# EasyEDA Pro project GController.eprj, board GController
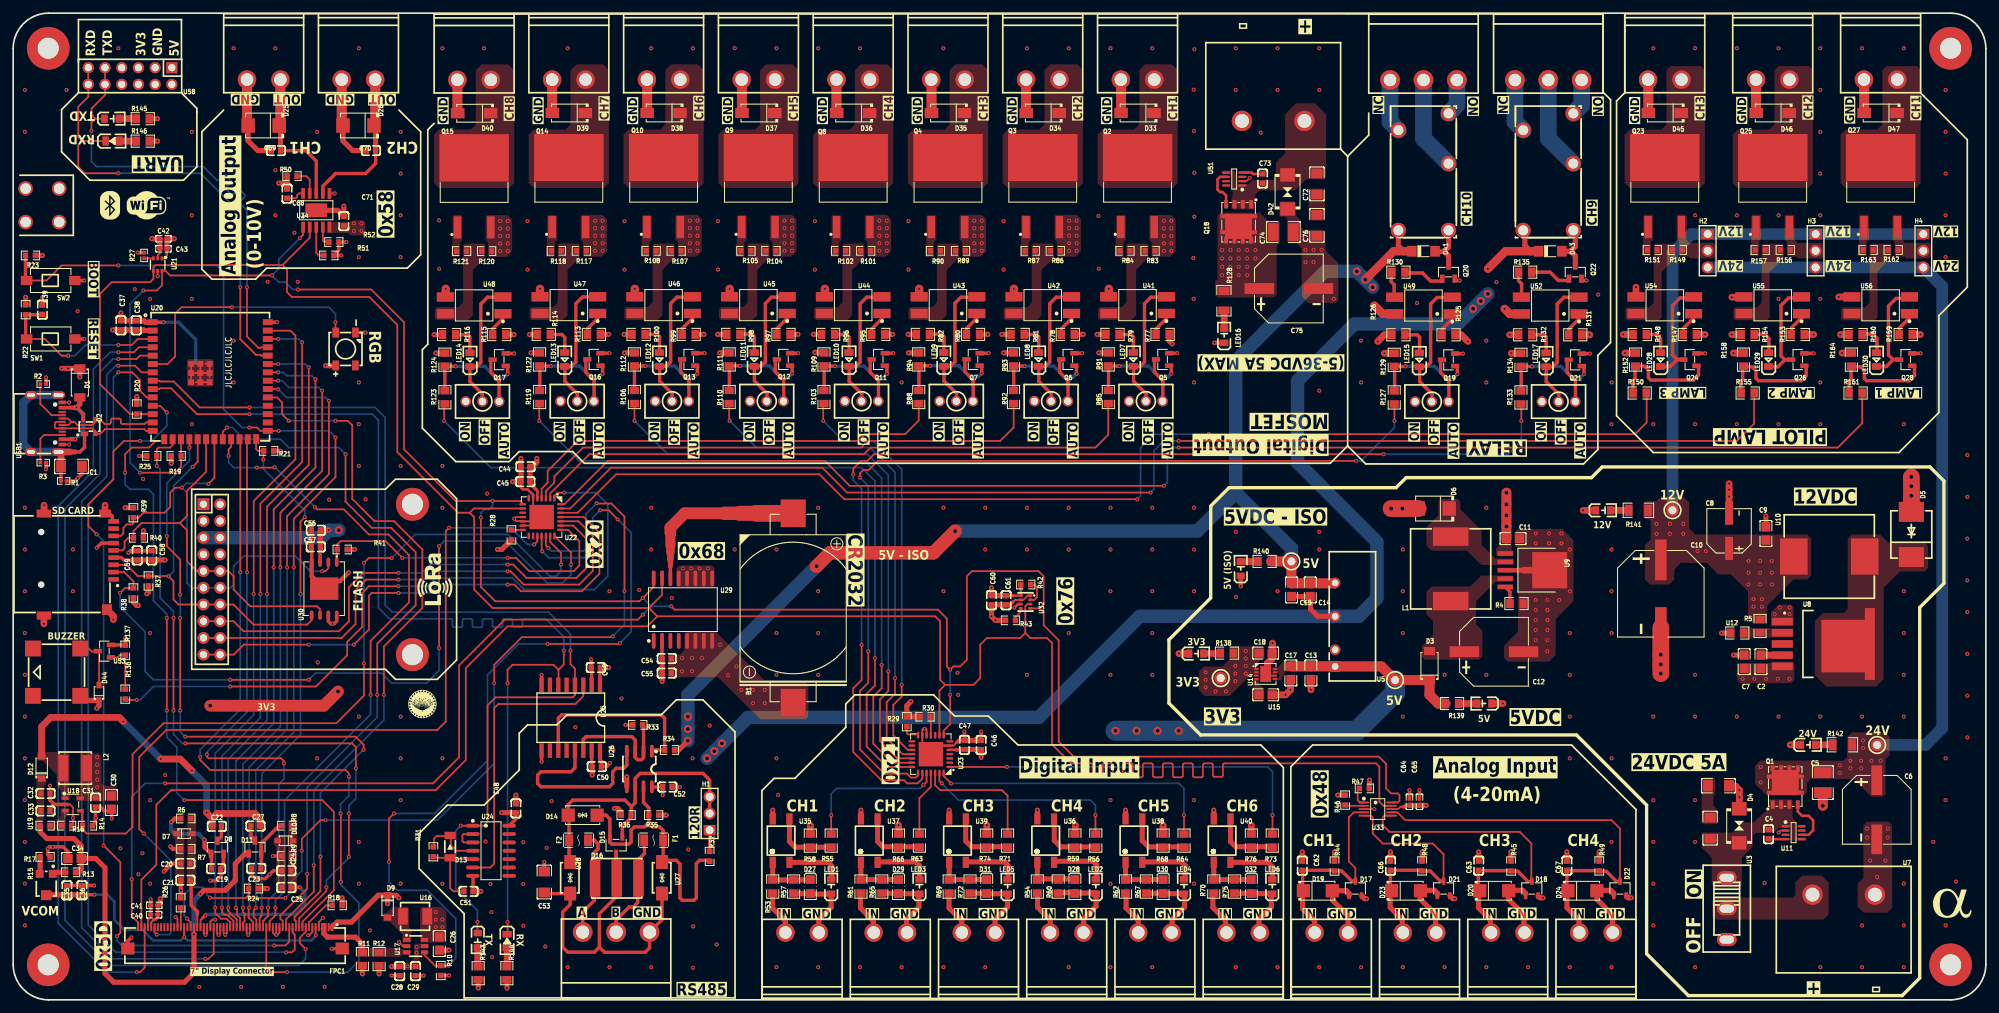
[diagram p17: board, top side]
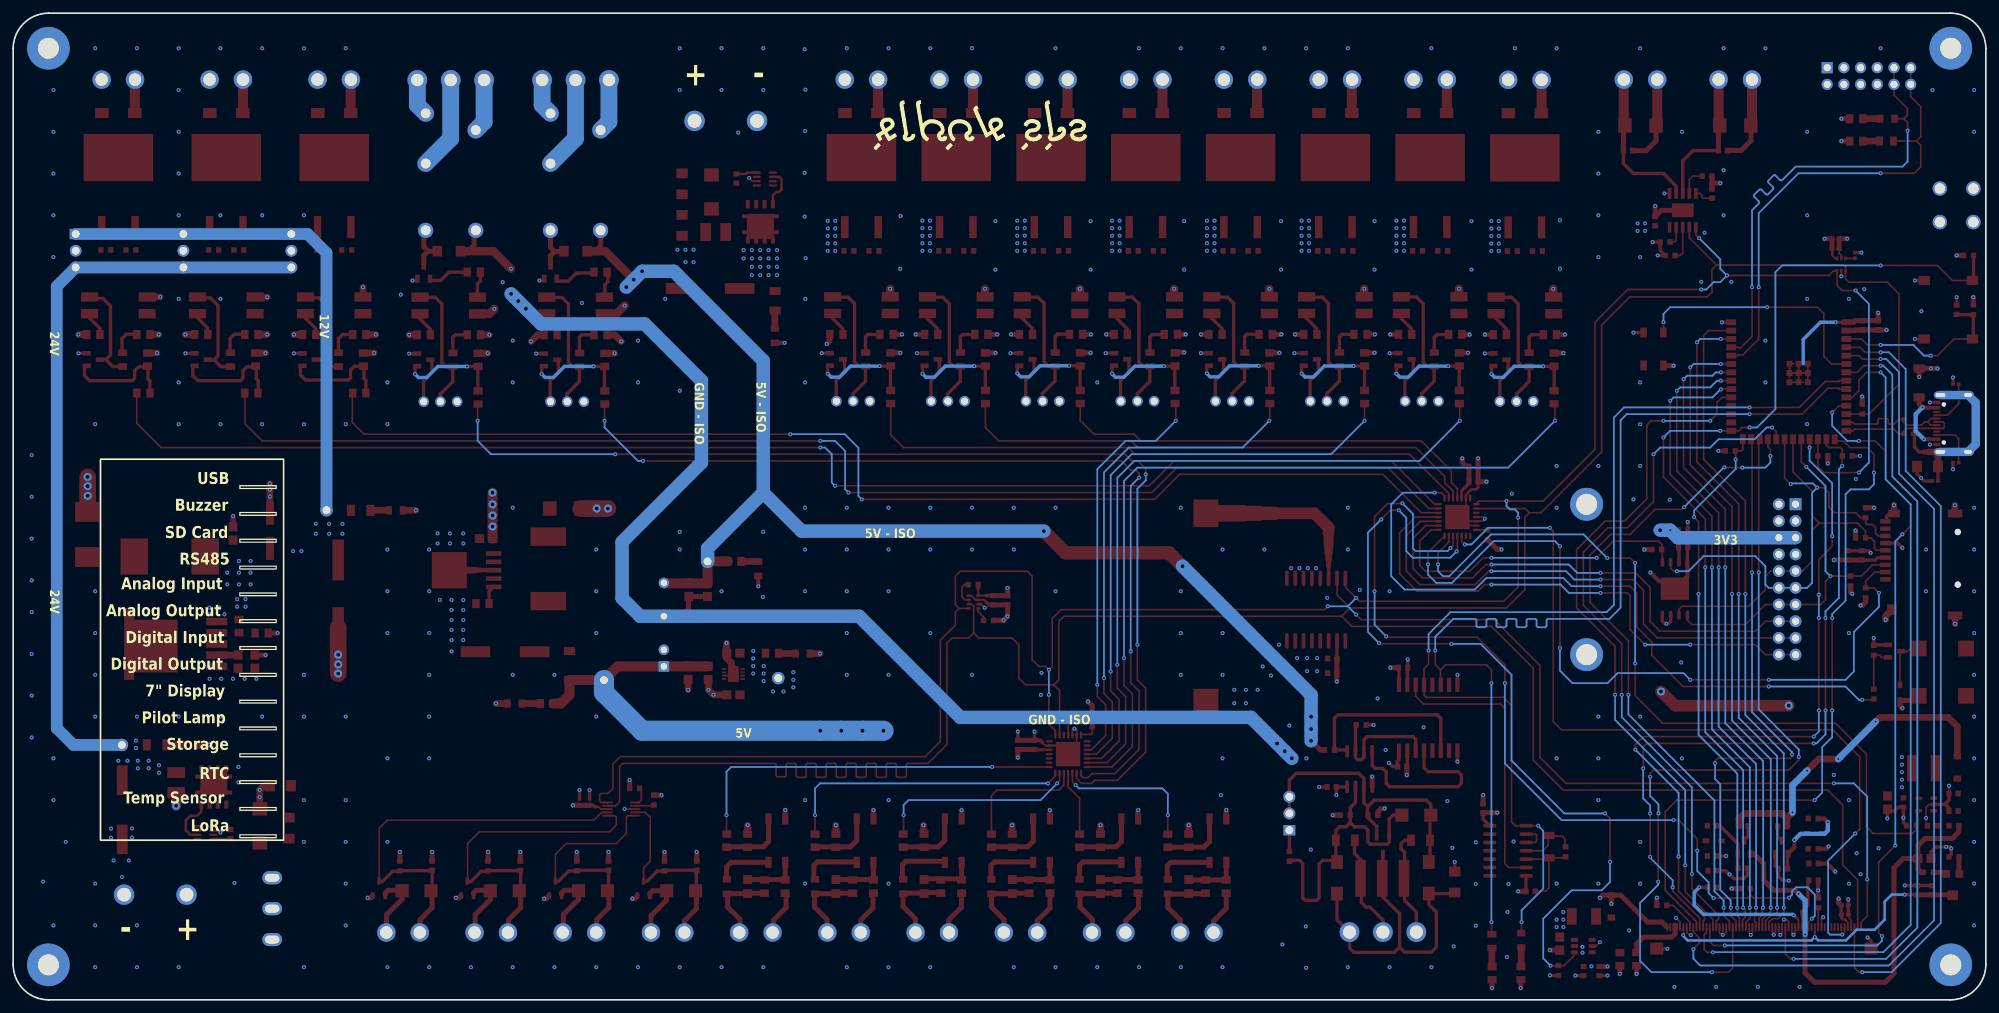
[diagram p18: board, bottom side, seen from below]

Outline 300 x 150 mm; copper layers: Top Layer, Ground, Power, Bottom Layer. Coordinates in mm from the lower left corner of the outline.
Outline path: 0,144.6 0,5.4 arc(1.58,1.58) 5.4,0 294.6,0 arc(298.42,1.58) 300,5.4 300,144.6 arc(298.42,148.42) 294.6,150 5.4,150 arc(1.58,148.42) 0,144.6
Stack: Top Layer 0.035mm Outer layer copper thickness 1oz / Dielectric1 0.2104mm 7628 RC49% 8.6mil / Ground 0.0152mm Inner layer copper thickness / Dielectric2 1.065mm 1.1mm H/HOZ Copper / Power 0.0152mm Inner layer copper thickness / Dielectric3 0.2104mm 7628 RC49% 8.6mil / Bottom Layer 0.035mm Outer layer copper thickness 1oz

## Design rules (mm)
net RS485A: RS4851
net RS485B: RS4851
net ESP_USB_P: USB
net ESP_USB_N: USB
net RS485A': RS4852
net RS485B': RS4852
net AI_SDA: I2C
net AI_SCL: I2C
net IO15: UART
net IO16: UART
net TXD0: UART1
net RXD0: UART1
net CC1: CC
net CC2: CC
net RS485_RXD': RS4853
net RS485_TXD': RS4853
template: Custom Config
spacing copperThickness1oz (default): track to track 0.152, other pairs 0.152 to 0.3
spacing copperThickness2oz: track to track 0.203, other pairs 0.152 to 0.3
spacing copperThicknessInner0.5oz: track to track 0.089, other pairs 0.152 to 0.3
track width copperThickness1oz (default): min 0.102, default 0.254, max 3.048
track width copperThickness2oz: min 0.203, default 0.254, max 2.54
track width copperThickness0.5oz: min 0.089, default 0.254, max 2.54
differential pair differentialPair (default): width min 0.127, default 0.254, max 2.54; gap min 0.152, default 0.152
via viaSize (default): diameter min 0.3, default 0.61, max 10; hole min 0.201, default 0.305, max 6.299
pour e1480 uses copperRegion1

## Placement (name value [footprint] x y rotation side)
B1  CR2032-BS-6-1  [BAT-TH_CR2032-BS-6-1]  118.62 59.58 90 top
BUZZER1  2.7kHz  [BUZ-SMD_4P-L8.5-W8.5-P8.50-BR]  6.6 49.81 90 top
C1  4.7nF  [C1206]  8.87 81.09 180 top
C2  1uF  [C0805]  265.79 51.41 270 top
C3  330nF  [C1206]  258.06 26.1 90 top
C4  100nF  [C0603]  266.95 25.18 90 top
C5  2.2uF  [C1210]  275.21 33.03 90 top
C6  220uF  [CAP-SMD_BD10.0-L10.3-W10.3-LS11.3-FD]  283.41 28.89 270 top
C7  1uF  [C0805]  263.25 51.41 270 top
C8  330uF  [CAP-SMD_BD6.3-L6.6-W6.6-LS7.3-FD]  260.95 71.3 90 top
C9  1uF  [C0805]  266.55 70.9 270 top
C10  470uF  [CAP-SMD_BD12.5-L13.0-W13.0-FD]  250.57 61.73 270 top
C11  1uF  [C0805]  228.09 70.12 180 top
C12  330uF  [CAP-SMD_BD10.0-L10.3-W10.3-LS11.3-FD]  225.2 52.92 0 top
C13  10uF  [C0805]  197.36 49.7 90 top
C14  10uF  [C0805]  197.26 62.32 90 top
C15  100nF  [C0805]  194.41 62.32 90 top
C16  330nF  [C1206]  259.33 32.55 0 top
C17  4.7uF  [C0805]  194.31 49.7 90 top
C18  4.7uF  [C0805]  190.47 52.72 180 top
C19  1uF  [C0603]  30.86 19.95 180 top
C20  100nF  [C0603]  26.2 20.72 0 top
C21  1uF  [C0603]  26.2 18.18 0 top
C22  100nF  [C0603]  30.97 26.38 180 top
C23  1uF  [C0603]  36.97 19.99 0 top
C24  1uF  [C0603]  41.55 19.63 0 top
C25  100nF  [C0603]  41.55 17.09 0 top
C26  10uF  [C0805]  64.8 8.56 90 top
C27  100nF  [C0603]  36.86 26.43 0 top
C28  1uF  [C0603]  58.79 4.37 90 top
C29  100nF  [C0603]  61.19 4.37 90 top
C30  10uF  [C0805]  14.95 29.99 90 top
C31  1uF  [C0603]  12.53 29.99 90 top
C32  1uF  [C0603]  4.91 31.37 180 top
C33  100nF  [C0603]  4.91 28.72 180 top
C34  10uF  [C0805]  9.34 21.49 0 top
C35  100nF  [C0603]  8.18 16.65 90 top
C36  1uF  [C0603]  10.46 16.65 270 top
C37  1uF  [C0603]  16.38 102.54 270 top
C38  100nF  [C0603]  18.72 102.54 270 top
C39  1uF  [C0603]  4.45 104.92 270 top
C40  100nF  [C0402]  21.44 12.94 0 top
C41  10uF  [C0402]  21.46 14.36 0 top
C42  10uF  [C0402]  22.86 115.71 0 top
C43  100nF  [C0402]  22.86 114.19 0 top
C44  1uF  [C0603]  77.9 81.06 180 top
C45  100nF  [C0603]  77.9 78.77 0 top
C46  1uF  [C0603]  147.21 38.76 90 top
C47  100nF  [C0603]  144.67 38.76 270 top
C48  100nF  [C0603]  76.45 29.1 270 top
C49  100nF  [C0603]  88.61 50.51 0 top
C50  100nF  [C0603]  88.76 35.46 0 top
C51  1nF  [C0603]  69.24 16.5 180 top
C52  100nF  [C0603]  99.49 32.36 180 top
C53  1nF  [C1206]  80.77 17.91 270 top
C54  100nF  [C0603]  99.38 51.89 180 top
C55  1uF  [C0603]  99.4 49.67 0 top
C56  10uF  [C0603]  46.03 71.4 180 top
C57  100nF  [C0603]  46.03 68.86 0 top
C58  10uF  [C0603]  21.08 67.58 90 top
C59  100nF  [C0603]  18.86 67.56 270 top
C60  1uF  [C0603]  148.77 60.75 90 top
C61  100nF  [C0603]  151 60.75 90 top
C62  10pF  [C0603]  196.04 20.4 270 top
C63  10pF  [C0603]  222.87 20.4 270 top
C64  100nF  [C0402]  212.34 30.11 270 top
C65  1uF  [C0402]  213.87 30.11 270 top
C66  10pF  [C0603]  209.46 20.4 270 top
C67  10pF  [C0603]  236.29 20.4 270 top
C68  1uF  [C0603]  41.65 122.57 90 top
C69  100nF  [C0603]  39.97 129.11 0 top
C70  100nF  [C0603]  54.42 129.11 0 top
C71  100nF  [C0603]  50.29 118.38 270 top
C72  330nF  [C1206]  198.27 124.04 90 top
C73  100nF  [C0603]  190.01 124.85 270 top
C74  2.2uF  [C1210]  193.16 116.73 180 top
C75  220uF  [CAP-SMD_BD10.0-L10.3-W10.3-LS11.3-FD]  194 108.14 0 top
C76  330nF  [C1206]  198.27 117.74 90 top
CN1  DB2ERC-5.08-3P-OG  [CONN-TH_3P-P5.08_DB2ERC-5.08-3P-OG]  91.69 10.3 0 top
CN2  DB2ERC-5.08-2P-GN  [CONN-TH_2P-P5.08_DB2ERC-5.08-2P]  200.47 10.24 0 top
CN3  DB2ERC-5.08-2P-GN  [CONN-TH_2P-P5.08_DB2ERC-5.08-2P]  227.29 10.24 0 top
CN4  DB2ERC-5.08-2P-GN  [CONN-TH_2P-P5.08_DB2ERC-5.08-2P]  213.88 10.24 0 top
CN5  DB2ERC-5.08-2P-GN  [CONN-TH_2P-P5.08_DB2ERC-5.08-2P]  240.71 10.24 0 top
CN6  DB2ERC-5.08-2P-GN  [CONN-TH_2P-P5.08_DB2ERC-5.08-2P]  38.1 139.9 180 top
CN7  DB2ERC-5.08-2P-GN  [CONN-TH_2P-P5.08_DB2ERC-5.08-2P]  52.51 139.9 180 top
CN8  DB2ERC-5.08-2P-GN  [CONN-TH_2P-P5.08_DB2ERC-5.08-2P]  119.98 10.24 0 top
CN9  DB2ERC-5.08-2P-GN  [CONN-TH_2P-P5.08_DB2ERC-5.08-2P]  160.22 10.24 0 top
CN10  DB2ERC-5.08-2P-GN  [CONN-TH_2P-P5.08_DB2ERC-5.08-2P]  133.4 10.24 0 top
CN11  DB2ERC-5.08-2P-GN  [CONN-TH_2P-P5.08_DB2ERC-5.08-2P]  173.64 10.24 0 top
CN12  DB2ERC-5.08-2P-GN  [CONN-TH_2P-P5.08_DB2ERC-5.08-2P]  146.81 10.24 0 top
CN13  DB2ERC-5.08-2P-GN  [CONN-TH_2P-P5.08_DB2ERC-5.08-2P]  187.05 10.24 0 top
CN14  DB2ERC-5.08-2P-GN  [CONN-TH_2P-P5.08_DB2ERC-5.08-2P]  170.99 139.9 180 top
CN15  DB2ERC-5.08-2P-GN  [CONN-TH_2P-P5.08_DB2ERC-5.08-2P]  156.58 139.9 180 top
CN16  DB2ERC-5.08-2P-GN  [CONN-TH_2P-P5.08_DB2ERC-5.08-2P]  142.16 139.9 180 top
CN17  DB2ERC-5.08-2P-GN  [CONN-TH_2P-P5.08_DB2ERC-5.08-2P]  127.75 139.9 180 top
CN18  DB2ERC-5.08-2P-GN  [CONN-TH_2P-P5.08_DB2ERC-5.08-2P]  113.34 139.9 180 top
CN19  DB2ERC-5.08-2P-GN  [CONN-TH_2P-P5.08_DB2ERC-5.08-2P]  98.92 139.9 180 top
CN20  DB2ERC-5.08-2P-GN  [CONN-TH_2P-P5.08_DB2ERC-5.08-2P]  84.51 139.9 180 top
CN21  DB2ERC-5.08-2P-GN  [CONN-TH_2P-P5.08_DB2ERC-5.08-2P]  70.1 139.87 180 top
CN22  DB2ERC-5.08-3P-BK  [CONN-TH_3P-P5.08_DB2ERC-5.08-3P-BK]  214.47 139.84 180 top
CN23  DB2ERC-5.08-3P-BK  [CONN-TH_3P-P5.08_DB2ERC-5.08-3P-BK]  233.46 139.84 180 top
CN24  DB2ERC-5.08-2P-GN  [CONN-TH_2P-P5.08_DB2ERC-5.08-2P]  251.17 139.9 180 top
CN25  DB2ERC-5.08-2P-GN  [CONN-TH_2P-P5.08_DB2ERC-5.08-2P]  267.59 139.9 180 top
CN26  DB2ERC-5.08-2P-GN  [CONN-TH_2P-P5.08_DB2ERC-5.08-2P]  284 139.9 180 top
D1  PMEG6030ETPX  [SOD-128_L3.7-W2.5-LS4.7-RD]  10.14 93.79 270 top
D2  PRTR5V0U2X,215  [SOT-143_L2.9-W1.3-P1.92-LS2.3-BR]  11.6 87.15 270 top
D3  PMEG6030ETPX  [SOD-128_L3.7-W2.5-LS4.7-RD]  215.39 50.82 90 top
D4  SMBJ33CA  [SMB_L4.3-W3.6-LS5.4-BI]  262.48 26.45 270 top
D5  B540C-13-F  [SMC_L7.1-W6.2-LS8.1-RD]  288.67 70.75 90 top
D6  B330B-13-F  [SMB_L4.6-W3.6-LS5.3-RD]  216.03 74.69 180 top
D7  BZT52C6V8S  [SOD-323_L1.8-W1.3-LS2.5-RD]  26.05 25.28 0 top
D8  BAT54S  [SOT-23-3_L2.9-W1.3-P1.90-LS2.4-BR]  31.06 23.19 270 top
D9  1N5819W  [SOD-123_L2.8-W1.8-LS3.7-RD]  56.95 14.21 270 top
D10  BZT52C18S  [SOD-323_L1.8-W1.3-LS2.5-RD]  41.4 24.18 180 top
D11  BAT54S  [SOT-23-3_L2.9-W1.3-P1.90-LS2.4-BR]  36.77 23.21 270 top
D12  1N5819W  [SOD-123_L2.8-W1.8-LS3.7-RD]  4.34 35.33 90 top
D13  LL4148  [LL-34_L3.5-W1.5-RD]  66.45 23.3 270 top
D14  SMAJ6.5CA  [SMA_L4.3-W2.6-LS5.1-BI]  86.61 28.08 0 top
D15  SM712  [SOT-23-3_L2.9-W1.6-P1.90-LS2.8-BR]  91.69 23.51 90 top
D16  3RL150M-5-S  [DIO-DT-SMD_3P-BD5.0-L7.2-P3.30]  91.8 18.48 0 top
D17  BAT54S,215  [SOT-23-3_L3.0-W1.7-P0.95-LS2.9-BR]  204.12 16.93 270 top
D18  BAT54S,215  [SOT-23-3_L3.0-W1.7-P0.95-LS2.9-BR]  230.95 16.93 270 top
D19  SMAJ33A  [SMA_L4.3-W2.6-LS5.2-RD]  198.41 16.59 0 top
D20  SMAJ33A  [SMA_L4.3-W2.6-LS5.2-RD]  225.24 16.59 0 top
D21  BAT54S,215  [SOT-23-3_L3.0-W1.7-P0.95-LS2.9-BR]  217.54 16.93 270 top
D22  BAT54S,215  [SOT-23-3_L3.0-W1.7-P0.95-LS2.9-BR]  244.36 16.93 270 top
D23  SMAJ33A  [SMA_L4.3-W2.6-LS5.2-RD]  211.82 16.59 0 top
D24  SMAJ33A  [SMA_L4.3-W2.6-LS5.2-RD]  238.65 16.59 0 top
D25  SMBJ12A  [SMB_L4.6-W3.6-LS5.3-RD]  38.1 132.92 180 top
D26  SMBJ12A  [SMB_L4.6-W3.6-LS5.3-RD]  52.51 132.92 180 top
D27  CD4148WSP  [D0805-RD]  121.23 17.22 270 top
D28  CD4148WSP  [D0805-RD]  161.47 17.22 270 top
D29  CD4148WSP  [D0805-RD]  134.64 17.22 270 top
D30  CD4148WSP  [D0805-RD]  174.88 17.22 270 top
D31  CD4148WSP  [D0805-RD]  148.06 17.22 270 top
D32  CD4148WSP  [D0805-RD]  188.3 17.22 270 top
D33  SS54  [SMA_L4.4-W2.8-LS5.4-R-RD]  170.99 134.82 180 top
D34  SS54  [SMA_L4.4-W2.8-LS5.4-R-RD]  156.58 134.82 180 top
D35  SS54  [SMA_L4.4-W2.8-LS5.4-R-RD]  142.16 134.82 180 top
D36  SS54  [SMA_L4.4-W2.8-LS5.4-R-RD]  127.75 134.82 180 top
D37  SS54  [SMA_L4.4-W2.8-LS5.4-R-RD]  113.34 134.82 180 top
D38  SS54  [SMA_L4.4-W2.8-LS5.4-R-RD]  98.92 134.82 180 top
D39  SS54  [SMA_L4.4-W2.8-LS5.4-R-RD]  84.51 134.82 180 top
D40  SS54  [SMA_L4.4-W2.8-LS5.4-R-RD]  70.1 134.79 180 top
D41  FDLL4148  [SOD-80_L3.5-W1.5-RD]  214.47 113.81 0 top
D42  SMBJ33CA  [SMB_L4.3-W3.6-LS5.4-BI]  193.8 122.82 90 top
D43  FDLL4148  [SOD-80_L3.5-W1.5-RD]  233.75 113.81 0 top
D44  1N4148WS  [SOD-323_L1.8-W1.3-LS2.5-RD]  13.05 46.69 90 top
D45  SS54  [SMA_L4.4-W2.8-LS5.4-R-RD]  251.17 134.82 180 top
D46  SS54  [SMA_L4.4-W2.8-LS5.4-R-RD]  267.59 134.82 180 top
D47  SS54  [SMA_L4.4-W2.8-LS5.4-R-RD]  284 134.82 180 top
F1  BSMD1206-020-30V  [F1206]  97.41 24.27 180 top
F2  BSMD1206-020-30V  [F1206]  85.98 24.27 0 top
FPC1  FPC-05FB-60PH20  [FPC-SMD_60P-P0.50_FPC-05FB-60PH20]  33.74 9.43 0 top
H1  2.54-1*3P针  [HDR-TH_3P-P2.54-V-M-1]  105.92 28.33 90 top
H2  2.54-1*3P针  [HDR-TH_3P-P2.54-V-M-1]  257.69 113.88 270 top
H3  2.54-1*3P针  [HDR-TH_3P-P2.54-V-M-1]  274.11 113.88 270 top
H4  2.54-1*3P针  [HDR-TH_3P-P2.54-V-M-1]  290.49 113.88 270 top
K1  ALQ105  [RELAY-TH_ALQ1XX]  214.47 125.87 90 top
K2  ALQ105  [RELAY-TH_ALQ1XX]  233.46 125.87 90 top
L1  33uH  [IND-SMD_L12.0-W12.0]  218.61 65.52 90 top
L2  22uH  [IND-SMD_L4.9-W4.9_NRS50XX]  9.44 35.22 180 top
LED1  LTST-C170TBKT  [LED0805-RD_BLUE]  124.4 17.22 90 top
LED2  LTST-C170TBKT  [LED0805-RD_BLUE]  164.65 17.22 90 top
LED3  LTST-C170TBKT  [LED0805-RD_BLUE]  137.82 17.22 90 top
LED4  LTST-C170TBKT  [LED0805-RD_BLUE]  178.06 17.22 90 top
LED5  LTST-C170TBKT  [LED0805-RD_BLUE]  151.23 17.22 90 top
LED6  LTST-C170TBKT  [LED0805-RD_BLUE]  191.47 17.22 90 top
LED7  NCD0805R1  [LED0805-R-RD]  170.36 97.36 90 top
LED8  NCD0805R1  [LED0805-R-RD]  155.94 97.36 90 top
LED9  NCD0805R1  [LED0805-R-RD]  141.53 97.36 90 top
LED10  NCD0805R1  [LED0805-R-RD]  127.11 97.36 90 top
LED11  NCD0805R1  [LED0805-R-RD]  112.7 97.36 90 top
LED12  NCD0805R1  [LED0805-R-RD]  98.29 97.36 90 top
LED13  NCD0805R1  [LED0805-R-RD]  83.87 97.36 90 top
LED14  NCD0805R1  [LED0805-R-RD]  69.47 97.32 90 top
LED15  NCD0805R1  [LED0805-R-RD]  213.84 97.3 90 top
LED16  17-215SURC/S530-A2/TR8  [LED0805-RD_RED]  184.17 100.98 90 top
LED17  NCD0805R1  [LED0805-R-RD]  233.11 97.3 90 top
LED18  17-215SURC/S530-A2/TR8  [LED0805-RD_RED]  179.92 52.64 0 top
LED19  17-215SURC/S530-A2/TR8  [LED0805-RD_RED]  223.73 45.05 180 top
LED20  17-215SURC/S530-A2/TR8  [LED0805-RD_RED]  186.69 65.55 90 top
LED21  17-215SURC/S530-A2/TR8  [LED0805-RD_RED]  241.8 74.42 0 top
LED22  17-215SURC/S530-A2/TR8  [LED0805-RD_RED]  272.96 38.77 0 top
LED23  17-215SURC/S530-A2/TR8  [LED0805-RD_RED]  70.66 9.05 270 top
LED24  SZYY0805YG  [LED0805-R-RD_GREEN]  75.12 8.93 270 top
LED25  17-215SURC/S530-A2/TR8  [LED0805-RD_RED]  14.99 133.96 0 top
LED26  SZYY0805YG  [LED0805-R-RD_GREEN]  15.11 130.56 0 top
LED27  XL-5050RGBC-WS2812B  [LED-SMD_4P-L5.0-W5.0-BL_XL-5050RGBC]  50.55 98.95 0 top
LED28  NCD0805R1  [LED0805-R-RD]  250.54 97.33 90 top
LED29  NCD0805R1  [LED0805-R-RD]  266.95 97.33 90 top
LED30  NCD0805R1  [LED0805-R-RD]  283.37 97.33 90 top
NOREF  -  [Pad_e1324]  60.72 52.48 0 top
NOREF#2  -  [Pad_e3840]  294.64 144.67 0 top
NOREF#3  -  [Pad_e1300]  60.72 75.34 0 top
NOREF#4  -  [Pad_e13738]  7 118.24 0 top
NOREF#5  -  [Pad_e13737]  7 123.34 0 top
NOREF#6  -  [Pad_e13739]  1.9 118.24 0 top
NOREF#7  -  [Pad_e3838]  294.64 5.32 0 top
NOREF#8  -  [Pad_e1349]  5.33 144.67 0 top
NOREF#9  -  [Pad_e3835]  5.33 5.32 0 top
NOREF#10  -  [Pad_e13735]  1.9 123.34 0 top
Q1  DMT6005LPS-13  [DFN-8_L6.0-W5.1-P1.27-LS6.2-BL]  269.49 32.42 0 top
Q2  IRF5305STRLPBF  [TO-263-2_L10.0-W9.1-P5.08-LS15.2-TL]  170.99 122.76 90 top
Q3  IRF5305STRLPBF  [TO-263-2_L10.0-W9.1-P5.08-LS15.2-TL]  156.58 122.76 90 top
Q4  IRF5305STRLPBF  [TO-263-2_L10.0-W9.1-P5.08-LS15.2-TL]  142.16 122.76 90 top
Q5  MMSS8050-L-TP  [SOT-23-3_L2.9-W1.3-P1.90-LS2.4-BR]  174.8 97.36 0 top
Q6  MMSS8050-L-TP  [SOT-23-3_L2.9-W1.3-P1.90-LS2.4-BR]  160.39 97.36 0 top
Q7  MMSS8050-L-TP  [SOT-23-3_L2.9-W1.3-P1.90-LS2.4-BR]  145.97 97.36 0 top
Q8  IRF5305STRLPBF  [TO-263-2_L10.0-W9.1-P5.08-LS15.2-TL]  127.75 122.76 90 top
Q9  IRF5305STRLPBF  [TO-263-2_L10.0-W9.1-P5.08-LS15.2-TL]  113.34 122.76 90 top
Q10  IRF5305STRLPBF  [TO-263-2_L10.0-W9.1-P5.08-LS15.2-TL]  98.92 122.76 90 top
Q11  MMSS8050-L-TP  [SOT-23-3_L2.9-W1.3-P1.90-LS2.4-BR]  131.56 97.36 0 top
Q12  MMSS8050-L-TP  [SOT-23-3_L2.9-W1.3-P1.90-LS2.4-BR]  117.15 97.36 0 top
Q13  MMSS8050-L-TP  [SOT-23-3_L2.9-W1.3-P1.90-LS2.4-BR]  102.73 97.36 0 top
Q14  IRF5305STRLPBF  [TO-263-2_L10.0-W9.1-P5.08-LS15.2-TL]  84.51 122.76 90 top
Q15  IRF5305STRLPBF  [TO-263-2_L10.0-W9.1-P5.08-LS15.2-TL]  70.1 122.72 90 top
Q16  MMSS8050-L-TP  [SOT-23-3_L2.9-W1.3-P1.90-LS2.4-BR]  88.32 97.36 0 top
Q17  MMSS8050-L-TP  [SOT-23-3_L2.9-W1.3-P1.90-LS2.4-BR]  73.91 97.32 0 top
Q18  DMT6005LPS-13  [DFN-8_L6.0-W5.1-P1.27-LS6.2-BL]  186.36 118.22 180 top
Q19  MMSS8050-L-TP  [SOT-23-3_L2.9-W1.3-P1.90-LS2.4-BR]  218.28 97.3 0 top
Q20  MMSS8050-L-TP  [SOT-23-3_L2.9-W1.3-P1.90-LS2.4-BR]  218.28 110.63 270 top
Q21  MMSS8050-L-TP  [SOT-23-3_L2.9-W1.3-P1.90-LS2.4-BR]  237.56 97.3 0 top
Q22  MMSS8050-L-TP  [SOT-23-3_L2.9-W1.3-P1.90-LS2.4-BR]  237.56 110.63 270 top
Q23  IRF5305STRLPBF  [TO-263-2_L10.0-W9.1-P5.08-LS15.2-TL]  251.17 122.76 90 top
Q24  MMSS8050-L-TP  [SOT-23-3_L2.9-W1.3-P1.90-LS2.4-BR]  254.98 97.33 0 top
Q25  IRF5305STRLPBF  [TO-263-2_L10.0-W9.1-P5.08-LS15.2-TL]  267.59 122.76 90 top
Q26  MMSS8050-L-TP  [SOT-23-3_L2.9-W1.3-P1.90-LS2.4-BR]  271.4 97.33 0 top
Q27  IRF5305STRLPBF  [TO-263-2_L10.0-W9.1-P5.08-LS15.2-TL]  284 122.76 90 top
Q28  MMSS8050-L-TP  [SOT-23-3_L2.9-W1.3-P1.90-LS2.4-BR]  287.81 97.33 0 top
R1  1MΩ  [R0402]  7.69 78.88 180 top
R2  5.1kΩ  [R0402]  4.57 93.61 180 top
R3  5.1kΩ  [R0402]  4.57 81.67 180 top
R4  47kΩ  [R0805]  228.63 60.24 0 top
R5  13kΩ  [R0805]  265.66 56.83 90 top
R6  1kΩ  [R0603]  26.26 27.57 0 top
R7  10kΩ  [R0603]  26.26 22.96 0 top
R8  1kΩ  [R0603]  41.61 26.48 0 top
R9  47kΩ  [R0603]  41.61 21.87 0 top
R10  4.7kΩ  [R0603]  65.02 4.46 270 top
R11  1.8Ω  [R0805]  53.11 6.19 90 top
R12  1.8Ω  [R0805]  55.65 6.19 90 top
R13  15kΩ  [R0603]  8.74 19.39 0 top
R14  10kΩ  [R0603]  11.3 26.48 180 top
R15  10kΩ  [RES-ADJ-SMD_3P-L3.0-W3.8-P1.75-BR]  5.03 17.54 90 top
R16  4.7kΩ  [R0603]  8.13 26.48 180 top
R17  6.8kΩ  [R0603]  4.86 21.74 180 top
R18  10kΩ  [R0603]  49.28 14.36 180 top
R19  4.7kΩ  [R0603]  24.79 82.69 180 top
R20  4.7kΩ  [R0603]  18.8 89.82 90 top
R21  10kΩ  [R0603]  38.86 83.45 180 top
R22  10kΩ  [R0603]  1.91 104.92 90 top
R23  10kΩ  [R0603]  2.63 113.17 0 top
R24  10kΩ  [R0603]  36.56 16.92 0 top
R25  10kΩ  [R0603]  21.08 82.69 0 top
R26  10kΩ  [R0603]  25.47 14.75 90 top
R27  10kΩ  [R0402]  19.91 113.17 90 top
R28  10kΩ  [R0603]  75.78 70.69 270 top
R29  10kΩ  [R0603]  135.9 42.29 90 top
R30  10kΩ  [R0603]  138.68 43.04 180 top
R31  56kΩ  [R0603]  63.91 22.51 90 top
R32  120Ω  [R0603]  105.92 21.81 90 top
R33  4.7kΩ  [R0603]  95 41.8 180 top
R34  10kΩ  [R0603]  99.82 37.99 0 top
R35  4.7kΩ  [R0603]  97.41 28.08 0 top
R36  4.7kΩ  [R0603]  93.22 28.08 0 top
R37  10kΩ  [R0603]  20.58 63.68 90 top
R38  10kΩ  [R0603]  18.29 61.86 90 top
R39  10kΩ  [R0603]  18.29 74.05 270 top
R40  10kΩ  [R0603]  19.05 70.24 180 top
R41  10kΩ  [R0603]  50.04 68.47 180 top
R42  10kΩ  [R0603]  154 63.13 180 top
R43  10kΩ  [R0603]  151.67 57.69 180 top
R44  150Ω  [R0603]  200.95 20.34 270 top
R45  150Ω  [R0603]  227.8 20.35 270 top
R46  10kΩ  [R0603]  202.56 30.37 270 top
R47  10kΩ  [R0603]  205.49 32.14 180 top
R48  150Ω  [R0603]  214.27 20.36 270 top
R49  150Ω  [R0603]  241.21 20.36 270 top
R50  4.7kΩ  [R0603]  42.41 125.23 180 top
R51  4.7kΩ  [R0603]  48.01 113.17 180 top
R52  4.7kΩ  [R0603]  48.77 115.2 180 top
R53  4.7kΩ  [R0805]  115.51 17.22 90 top
R54  4.7kΩ  [R0805]  155.76 17.22 90 top
R55  100Ω  [R0805]  124.4 24.21 270 top
R56  100Ω  [R0805]  164.65 24.21 270 top
R57  10kΩ  [R0805]  118.69 17.22 90 top
R58  10kΩ  [R0805]  121.23 24.21 270 top
R59  10kΩ  [R0805]  161.47 24.21 270 top
R60  10kΩ  [R0805]  158.93 17.22 90 top
R61  4.7kΩ  [R0805]  128.93 17.22 90 top
R62  4.7kΩ  [R0805]  169.17 17.22 90 top
R63  100Ω  [R0805]  137.82 24.21 270 top
R64  100Ω  [R0805]  178.06 24.21 270 top
R65  10kΩ  [R0805]  132.1 17.22 90 top
R66  10kΩ  [R0805]  134.64 24.21 270 top
R67  10kΩ  [R0805]  172.34 17.22 90 top
R68  10kΩ  [R0805]  174.88 24.21 270 top
R69  4.7kΩ  [R0805]  142.34 17.22 90 top
R70  4.7kΩ  [R0805]  182.58 17.22 90 top
R71  100Ω  [R0805]  151.23 24.21 270 top
R72  10kΩ  [R0805]  145.52 17.22 90 top
R73  100Ω  [R0805]  191.47 24.21 270 top
R74  10kΩ  [R0805]  148.06 24.21 270 top
R75  10kΩ  [R0805]  185.76 17.22 90 top
R76  10kΩ  [R0805]  188.3 24.21 270 top
R77  4.7kΩ  [R0805]  174.8 101.17 180 top
R78  4.7kΩ  [R0805]  160.39 101.17 180 top
R79  2kΩ  [R0805]  167.18 101.17 180 top
R80  4.7kΩ  [R0805]  145.97 101.17 180 top
R81  2kΩ  [R0805]  152.77 101.17 180 top
R82  2kΩ  [R0805]  138.35 101.17 180 top
R83  10kΩ  [R0603]  172.9 113.87 0 top
R84  1kΩ  [R0603]  169.09 113.87 180 top
R85  4.7kΩ  [R0805]  166.55 91.64 90 top
R86  10kΩ  [R0603]  158.48 113.87 0 top
R87  1kΩ  [R0603]  154.67 113.87 180 top
R88  4.7kΩ  [R0805]  137.72 91.64 90 top
R89  10kΩ  [R0603]  144.07 113.87 0 top
R90  1kΩ  [R0603]  140.26 113.87 180 top
R91  100kΩ  [R0805]  166.55 97.36 270 top
R92  4.7kΩ  [R0805]  152.13 91.64 90 top
R93  100kΩ  [R0805]  152.13 97.36 270 top
R94  100kΩ  [R0805]  137.72 97.36 270 top
R95  4.7kΩ  [R0805]  131.56 101.17 180 top
R96  2kΩ  [R0805]  123.94 101.17 180 top
R97  4.7kΩ  [R0805]  117.15 101.17 180 top
R98  2kΩ  [R0805]  109.53 101.17 180 top
R99  4.7kΩ  [R0805]  102.73 101.17 180 top
R100  2kΩ  [R0805]  95.11 101.17 180 top
R101  10kΩ  [R0603]  129.66 113.87 0 top
R102  1kΩ  [R0603]  125.84 113.87 180 top
R103  4.7kΩ  [R0805]  123.31 91.64 90 top
R104  10kΩ  [R0603]  115.24 113.87 0 top
R105  1kΩ  [R0603]  111.43 113.87 180 top
R106  4.7kΩ  [R0805]  94.48 91.64 90 top
R107  10kΩ  [R0603]  100.83 113.87 0 top
R108  1kΩ  [R0603]  97.02 113.87 180 top
R109  100kΩ  [R0805]  123.31 97.36 270 top
R110  4.7kΩ  [R0805]  108.89 91.64 90 top
R111  100kΩ  [R0805]  108.89 97.36 270 top
R112  100kΩ  [R0805]  94.48 97.36 270 top
R113  4.7kΩ  [R0805]  88.32 101.17 180 top
R114  2kΩ  [R0805]  80.7 101.17 180 top
R115  4.7kΩ  [R0805]  73.91 101.13 180 top
R116  2kΩ  [R0805]  66.29 101.13 180 top
R117  10kΩ  [R0603]  86.41 113.87 0 top
R118  1kΩ  [R0603]  82.6 113.87 180 top
R119  4.7kΩ  [R0805]  80.06 91.64 90 top
R120  10kΩ  [R0603]  72.01 113.83 0 top
R121  1kΩ  [R0603]  68.2 113.83 180 top
R122  100kΩ  [R0805]  80.06 97.36 270 top
R123  4.7kΩ  [R0805]  65.66 91.61 90 top
R124  100kΩ  [R0805]  65.66 97.32 270 top
R125  4.7kΩ  [R0805]  218.28 101.11 180 top
R126  2kΩ  [R0805]  210.66 101.11 180 top
R127  4.7kΩ  [R0805]  210.03 91.58 90 top
R128  4.7kΩ  [R1206]  184.13 106.27 90 top
R129  100kΩ  [R0805]  210.03 97.3 270 top
R130  4.7kΩ  [R0805]  210.66 110.63 0 top
R131  4.7kΩ  [R0805]  237.56 101.11 180 top
R132  2kΩ  [R0805]  229.94 101.11 180 top
R133  4.7kΩ  [R0805]  229.3 91.58 90 top
R134  100kΩ  [R0805]  229.3 97.3 270 top
R135  4.7kΩ  [R0805]  229.94 110.63 0 top
R136  1kΩ  [R0603]  17.05 46.48 90 top
R137  10kΩ  [R0603]  17.05 53.15 270 top
R138  270Ω  [R0805]  184.59 52.7 0 top
R139  620Ω  [R0805]  218.82 45.04 180 top
R140  620Ω  [R0805]  190.31 66.66 0 top
R141  2.2kΩ  [R1206]  247.16 74.42 0 top
R142  4.7kΩ  [R1206]  278.18 38.77 0 top
R143  1kΩ  [R0805]  70.71 4.05 270 top
R144  1kΩ  [R0805]  75.08 4.05 270 top
R145  1kΩ  [R0805]  19.71 133.95 0 top
R146  1kΩ  [R0805]  19.71 130.54 0 top
R147  4.7kΩ  [R0805]  254.98 101.14 180 top
R148  2kΩ  [R0805]  247.36 101.14 180 top
R149  10kΩ  [R0603]  253.08 113.99 0 top
R150  4.7kΩ  [R0805]  247.36 92.25 180 top
R151  1kΩ  [R0603]  249.27 113.99 180 top
R152  100kΩ  [R0805]  246.73 97.33 270 top
R153  4.7kΩ  [R0805]  271.4 101.14 180 top
R154  2kΩ  [R0805]  263.78 101.14 180 top
R155  4.7kΩ  [R0805]  263.78 92.25 180 top
R156  10kΩ  [R0603]  269.49 113.99 0 top
R157  1kΩ  [R0603]  265.68 113.99 180 top
R158  100kΩ  [R0805]  263.14 97.33 270 top
R159  4.7kΩ  [R0805]  287.81 101.14 180 top
R160  2kΩ  [R0805]  280.19 101.14 180 top
R161  4.7kΩ  [R0805]  280.19 92.25 180 top
R162  10kΩ  [R0603]  285.91 113.99 0 top
R163  1kΩ  [R0603]  282.1 113.99 180 top
R164  100kΩ  [R0805]  279.56 97.33 270 top
SW1  TS-1101S-C-B-B-B-A  [SW-SMD_L6.0-W3.5-LS8.0]  5.71 100.47 180 top
SW2  TS-1101S-C-B-B-B-A  [SW-SMD_L6.0-W3.5-LS8.0]  5.71 109.36 180 top
SW3  2AS3T1A1M2QES  [SW-TH_2AS3T1A1M2QES]  172.26 91.01 270 top
SW4  2AS3T1A1M2QES  [SW-TH_2AS3T1A1M2QES]  157.85 91.01 270 top
SW5  2AS3T1A1M2QES  [SW-TH_2AS3T1A1M2QES]  143.43 91.01 270 top
SW6  2AS3T1A1M2QES  [SW-TH_2AS3T1A1M2QES]  129.02 91.01 270 top
SW7  2AS3T1A1M2QES  [SW-TH_2AS3T1A1M2QES]  114.61 91.01 270 top
SW8  2AS3T1A1M2QES  [SW-TH_2AS3T1A1M2QES]  100.19 91.01 270 top
SW9  2AS3T1A1M2QES  [SW-TH_2AS3T1A1M2QES]  85.78 91.01 270 top
SW10  2AS3T1A1M2QES  [SW-TH_2AS3T1A1M2QES]  71.37 90.97 270 top
SW11  2AS3T1A1M2QES  [SW-TH_2AS3T1A1M2QES]  215.74 90.94 270 top
SW12  2AS3T1A1M2QES  [SW-TH_2AS3T1A1M2QES]  235.02 90.94 270 top
U1  RH-5000  [TEST-TH_BD2.54-P1.4_RED]  283.46 38.75 0 top
U2  RH-5000  [TEST-TH_BD2.54-P1.4_RED]  252.35 74.44 270 top
U3  SS-12M10G5  [SW-TH_XKB_SS-12M10G5]  260.6 13.86 270 top
U4  RH-5000  [TEST-TH_BD2.54-P1.4_RED]  210.15 48.61 180 top
U5  B0505S-3WR2  [PWRM-TH_B0505S-3WR2]  201.04 57.04 90 top
U6  RH-5000  [TEST-TH_BD2.54-P1.4_RED]  194.39 66.66 0 top
U7  DBT50G-9.5-2P-BK-P OGC  [CONN-TH_2P-P9.50_DBT50G-9.5-2P]  278.38 15.99 0 top
U8  XL4015E1  [TO-263-5_L10.2-W8.9-P1.70-TL]  274.05 54.1 0 top
U9  XL1507-5.0E1  [TO-252-5_L6.5-W5.6-P1.27-LS9.5-TL]  230.3 65.32 0 top
U10  47uH  [IND-SMD_L13.5-W12.5]  276.19 67.39 180 top
U11  LM74500QDDFRQ1  [SOT-23-8_L3.0-W1.7-P0.65-LS2.8-BR]  270.76 25.41 180 top
U12  1.5kΩ  [R0805]  262.2 55.77 0 top
U13  RH-5000  [TEST-TH_BD2.54-P1.4_RED]  183.64 48.91 0 top
U14  ADM7172ACPZ-3.3-R7  [DFN-8_L3.0-W3.0-P0.50-BL-EP]  190.47 49.54 270 top
U15  1nF  [C0805]  190.47 46.37 180 top
U16  10uH  [IND-SMD_L4.4-W4.2_BCIHP0412SC]  61.12 12.68 180 top
U17  AP3032KTR-G1  [SOT-23-6_L2.9-W1.6-P0.95-LS2.8-BR]  61.22 8.17 180 top
U18  AP3012KTR-G1  [TSOT-23-5_L2.9-W1.6-P0.95-LS2.8-BL]  9.07 29.71 270 top
U19  33kΩ  [R0603]  4.86 26.48 180 top
U20  ESP32-S3-WROOM-1U-N16R8  [WIRELM-SMD_ESP32-S3-WROOM-1U]  29.97 94.12 0 top
U21  LTC4311CSC6#TRPBF  [SC-70-6_L2.1-W1.3-P0.65-LS2.1-BR]  21.98 111.77 90 top
U22  MCP23017T-E/ML  [QFN-28_L6.0-W6.0-P0.65-BL-EP3.7]  80.37 73.4 180 top
U23  MCP23017T-E/ML  [QFN-28_L6.0-W6.0-P0.65-BL-EP3.7]  139.56 37.35 90 top
U24  74HC04D  [SOIC-14_L8.7-W3.9-P1.27-LS6.0-BL]  72.67 22.66 270 top
U25  π141E61Q  [WSOIC-16_L10.3-W7.5-P1.27-LS10.3-BL]  84.8 42.89 180 top
U26  SP485EEN-L/TR  [SOIC-8_L5.0-W4.0-P1.27-LS6.0-BL]  95.23 35.09 180 top
U27  SMAJ12CA  [SMA_L4.3-W2.7-LS5.1-BI]  98.68 18.56 90 top
U28  SMAJ12CA  [SMA_L4.3-W2.7-LS5.1-BI]  84.71 18.56 90 top
U29  DS3231SN#  [SOIC-16_L10.3-W7.5-P1.27-LS10.3-BL]  101.85 59.32 0 top
U30  W25N01GVZEIG  [WSON-8_L8.0-W6.10-P1.27-BL-EP]  47.3 62.51 180 top
U31  KH-TF-07DT  [SIM-SMD_C9900007362]  9.98 66.18 270 top
U32  BMP280  [LGA-8_L2.5-W2.0-P0.65_AMP6127]  153.96 60.48 0 top
U33  ADS1115IDGSR  [MSOP-10_L3.0-W3.0-P0.50-LS5.0-BL]  207.52 29 270 top
U34  GP8413-TC50-EW  [ESOP-10_L4.9-W3.9-P1.00-LS6.0-BL-EP]  46.1 120.03 0 top
U35  EL357N(B)(TA)-G  [OPTO-SMD-4_L4.4-W4.1-P2.54-LS7.0-TL]  116.78 24.21 90 top
U36  EL357N(B)(TA)-G  [OPTO-SMD-4_L4.4-W4.1-P2.54-LS7.0-TL]  157.03 24.21 90 top
U37  EL357N(B)(TA)-G  [OPTO-SMD-4_L4.4-W4.1-P2.54-LS7.0-TL]  130.2 24.21 90 top
U38  EL357N(B)(TA)-G  [OPTO-SMD-4_L4.4-W4.1-P2.54-LS7.0-TL]  170.44 24.21 90 top
U39  EL357N(B)(TA)-G  [OPTO-SMD-4_L4.4-W4.1-P2.54-LS7.0-TL]  143.61 24.21 90 top
U40  EL357N(B)(TA)-G  [OPTO-SMD-4_L4.4-W4.1-P2.54-LS7.0-TL]  183.85 24.21 90 top
U41  CYPC817(C-TP2)  [SOP-4_L6.4-W4.6-P2.54-LS10.2-TL]  170.99 105.61 180 top
U42  CYPC817(C-TP2)  [SOP-4_L6.4-W4.6-P2.54-LS10.2-TL]  156.58 105.61 180 top
U43  CYPC817(C-TP2)  [SOP-4_L6.4-W4.6-P2.54-LS10.2-TL]  142.16 105.61 180 top
U44  CYPC817(C-TP2)  [SOP-4_L6.4-W4.6-P2.54-LS10.2-TL]  127.75 105.61 180 top
U45  CYPC817(C-TP2)  [SOP-4_L6.4-W4.6-P2.54-LS10.2-TL]  113.34 105.61 180 top
U46  CYPC817(C-TP2)  [SOP-4_L6.4-W4.6-P2.54-LS10.2-TL]  98.92 105.61 180 top
U47  CYPC817(C-TP2)  [SOP-4_L6.4-W4.6-P2.54-LS10.2-TL]  84.51 105.61 180 top
U48  CYPC817(C-TP2)  [SOP-4_L6.4-W4.6-P2.54-LS10.2-TL]  70.1 105.58 180 top
U49  CYPC817(C-TP2)  [SOP-4_L6.4-W4.6-P2.54-LS10.2-TL]  214.47 105.55 180 top
U50  DBT50G-9.5-2P-BK-P OGC  [CONN-TH_2P-P9.50_DBT50G-9.5-2P]  191.62 133.62 180 top
U51  LM74500QDDFRQ1  [SOT-23-8_L3.0-W1.7-P0.65-LS2.8-BR]  185.69 124.78 0 top
U52  CYPC817(C-TP2)  [SOP-4_L6.4-W4.6-P2.54-LS10.2-TL]  233.75 105.55 180 top
U53  SS8050  [SOT-23-3_L2.9-W1.3-P1.90-LS2.4-BR]  13.87 53.01 0 top
U54  CYPC817(C-TP2)  [SOP-4_L6.4-W4.6-P2.54-LS10.2-TL]  251.17 105.59 180 top
U55  CYPC817(C-TP2)  [SOP-4_L6.4-W4.6-P2.54-LS10.2-TL]  267.59 105.59 180 top
U56  CYPC817(C-TP2)  [SOP-4_L6.4-W4.6-P2.54-LS10.2-TL]  284 105.59 180 top
U57  PM254-2-10-Z-8.5  [HDR-TH_20P-P2.54-V-F-R2-C10-S2.54]  30.21 63.91 270 top
U58  PM254-2-06-Z-8.5  [HDR-TH_12P-P2.54-V-F-R2-C6-S2.54]  17.78 140.44 180 top
USB1  TYPE-C 16PIN 2MD(073)  [USB-C-SMD_TYPE-C-6PIN-2MD-073]  5.09 87.62 270 top

## Footprints (pads in the part's own frame, mm; a bottom-side part is the same pattern mirrored in y, then rotated)
BAT-TH_CR2032-BS-6-1
  rect 4.2x3.8 smd: 1(14.385,0) 2(-14.385,0)
BUZ-SMD_4P-L8.5-W8.5-P8.50-BR
  rect 2.4x2.4 smd: 1(-3.6,-3.6) 2(3.6,-3.6) 3(3.599,3.599) 4(-3.6,3.6)
C0402
  rect 0.79x0.54 smd: 1(-0.545,0) 2(0.545,0)
C0603
  rect 0.8x0.9 smd: 1(-0.7,0) 2(0.7,0)
C0805
  rect 1.41x1.35 smd: 1(-1,0) 2(1,0)
C1206
  rect 1.485x1.728 smd: 1(-1.593,0) 2(1.593,0)
C1210
  rect 1.635x2.7 smd: 1(-1.518,0) 2(1.518,0)
CAP-SMD_BD6.3-L6.6-W6.6-LS7.3-FD
  rect 3.5x1.2 smd: 1(-2.67,0) 2(2.67,0)
CAP-SMD_BD10.0-L10.3-W10.3-LS11.3-FD
  rect 4.5x1.65 smd: 1(-4.5,0) 2(4.5,0)
CAP-SMD_BD12.5-L13.0-W13.0-FD
  rect 6.2x1.75 smd: 1(-5.145,0) 2(5.145,0)
CONN-TH_2P-P5.08_DB2ERC-5.08-2P
  round 2.8 hole 1.9: 1(-2.54,0) 2(2.54,0)
CONN-TH_2P-P9.50_DBT50G-9.5-2P
  round 3.1 hole 2.1: 1(-4.75,0) 2(4.75,0)
CONN-TH_3P-P5.08_DB2ERC-5.08-3P-BK
  round 3 hole 1.9: 1(-5.08,0) 2(0,0) 3(5.08,0)
CONN-TH_3P-P5.08_DB2ERC-5.08-3P-OG
  round 3 hole 2: 1(-5.08,0) 2(0,0) 3(5.08,0)
D0805-RD
  rect 1.335x1.35 smd: 1(-1.067,0) 2(1.067,0)
DFN-8_L3.0-W3.0-P0.50-BL-EP
  rect 0.28x0.665 smd: 1(-0.75,-1.407) 2(-0.25,-1.407) 3(0.25,-1.407) 4(0.75,-1.407) 5(0.75,1.407) 6(0.25,1.407) 7(-0.25,1.407) 8(-0.75,1.407)
  rect 2.45x1.65 smd: 9(0,0)
DFN-8_L6.0-W5.1-P1.27-LS6.2-BL
  rect 0.61x1.27 smd: 1(-1.905,-2.732) 2(-0.635,-2.732) 3(0.634,-2.732) 4(1.905,-2.732)
  rect 0.61x1.02 smd: 5(1.905,2.732) 6(0.635,2.732) 7(-0.635,2.732) 8(-1.905,2.732)
  rect 1.2x0.6 smd: 8(-2.205,1.527) 8(-2.205,-0.898) 8(2.205,1.527) 8(2.205,-0.898)
  rect 4.1x3.81 smd: 8(0,0.627)
DIO-DT-SMD_3P-BD5.0-L7.2-P3.30
  rect 1.6x5.6 smd: 1(-3.3,0) 2(3.3,0) 3(0,0)
ESOP-10_L4.9-W3.9-P1.00-LS6.0-BL-EP
  rect 0.56x1.64 smd: 1(-2,-2.57) 2(-1,-2.57) 3(0,-2.57) 4(1,-2.57) 5(2,-2.57) 6(2,2.57) 7(1,2.57) 8(0,2.57) 9(-1,2.57) 10(-2,2.57)
  rect 3.3x2.1 smd: 11(0,0)
F1206
  rect 1.19x1.728 smd: 1(-1.445,0) 2(1.445,0)
FPC-SMD_60P-P0.50_FPC-05FB-60PH20
  rect 0.3x1.2 smd: 1(14.75,1.625) 2(14.25,1.625) 3(13.75,1.625) 4(13.25,1.625) 5(12.75,1.625) 6(12.25,1.625) 7(11.75,1.625) 8(11.25,1.625) 9(10.75,1.625) 10(10.25,1.625) 11(9.75,1.625) 12(9.25,1.625) 13(8.75,1.625) 14(8.25,1.625) 15(7.75,1.625) 16(7.25,1.625) 17(6.75,1.625) 18(6.25,1.625) 19(5.75,1.625) 20(5.25,1.625) 21(4.75,1.625) 22(4.25,1.625) 23(3.75,1.625) 24(3.25,1.625) 25(2.75,1.625) 26(2.25,1.625) 27(1.75,1.625) 28(1.25,1.625) 29(0.75,1.625) 30(0.25,1.625) 31(-0.25,1.625) 32(-0.75,1.625) 33(-1.25,1.625) 34(-1.75,1.625) 35(-2.25,1.625) 36(-2.75,1.625) 37(-3.25,1.625) 38(-3.75,1.625) 39(-4.25,1.625) 40(-4.75,1.625) 41(-5.25,1.625) 42(-5.75,1.625) 43(-6.25,1.625) 44(-6.75,1.625) 45(-7.25,1.625) 46(-7.75,1.625) 47(-8.25,1.625) 48(-8.75,1.625) 49(-9.25,1.625) 50(-9.75,1.625) 51(-10.25,1.625) 52(-10.75,1.625) 53(-11.25,1.625) 54(-11.75,1.625) 55(-12.25,1.625) 56(-12.75,1.625) 57(-13.25,1.625) 58(-13.75,1.625) 59(-14.25,1.625) 60(-14.75,1.625)
  rect 2x1.8 smd: 61(-16.3,-1.625) 62(16.3,-1.625)
HDR-TH_3P-P2.54-V-M-1
  rect 1.575x1.8 hole 1.2: 1(-2.54,0)
  round 1.8 hole 1.2: 2(0,0) 3(2.54,0)
HDR-TH_12P-P2.54-V-F-R2-C6-S2.54
  rect 1.7x1.7 hole 1.1: 1(-6.35,-1.27)
  round 1.7 hole 1.1: 2(-6.35,1.27) 3(-3.81,-1.27) 4(-3.81,1.27) 5(-1.27,-1.27) 6(-1.27,1.27) 7(1.27,-1.27) 8(1.27,1.27) 9(3.81,-1.27) 10(3.81,1.27) 11(6.35,-1.27) 12(6.35,1.27)
HDR-TH_20P-P2.54-V-F-R2-C10-S2.54
  rect 1.8x1.8 hole 1.1: 1(-11.43,-1.27)
  round 1.8 hole 1.1: 2(-11.43,1.27) 3(-8.89,-1.27) 4(-8.89,1.27) 5(-6.35,-1.27) 6(-6.35,1.27) 7(-3.81,-1.27) 8(-3.81,1.27) 9(-1.27,-1.27) 10(-1.27,1.27) 11(1.27,-1.27) 12(1.27,1.27) 13(3.81,-1.27) 14(3.81,1.27) 15(6.35,-1.27) 16(6.35,1.27) 17(8.89,-1.27) 18(8.89,1.27) 19(11.43,-1.27) 20(11.43,1.27)
IND-SMD_L4.4-W4.2_BCIHP0412SC
  rect 1.5x2.5 smd: 1(-1.85,0) 2(1.85,0)
IND-SMD_L4.9-W4.9_NRS50XX
  rect 1.5x4 smd: 1(-1.8,0) 2(1.8,0)
IND-SMD_L12.0-W12.0
  rect 2.8x5.4 smd: 1(4.9,0) 2(-4.9,0)
IND-SMD_L13.5-W12.5
  rect 4.185x5.5 smd: 1(-5.393,0) 2(5.393,0)
LED0805-R-RD
  rect 1x1.399 smd: 1(1.05,0) 2(-1.05,0)
LED0805-R-RD_GREEN
  rect 1x1.399 smd: 1(1.05,0) 2(-1.05,0)
LED0805-RD_BLUE
  rect 1x1.25 smd: 1(-1.1,0) 2(1.1,0)
LED0805-RD_RED
  rect 1x1.25 smd: 1(-1.1,0) 2(1.1,0)
LED-SMD_4P-L5.0-W5.0-BL_XL-5050RGBC
  rect 1x1.5 smd: 1(-1.5,-2.5) 2(1.5,-2.5) 3(1.5,2.5) 4(-1.5,2.5)
LGA-8_L2.5-W2.0-P0.65_AMP6127
  rect 0.6x0.4 smd: 1(0.725,0.975) 2(0.725,0.325) 3(0.725,-0.325) 4(0.725,-0.975) 5(-0.725,-0.975) 6(-0.725,-0.325) 7(-0.725,0.325) 8(-0.725,0.975)
LL-34_L3.5-W1.5-RD
  rect 1.1x1.7 smd: 1(-1.7,0) 2(1.7,0)
MSOP-10_L3.0-W3.0-P0.50-LS5.0-BL
  oval 0.28x1.62 smd: 1(-1,-2.11) 2(-0.5,-2.11) 3(0,-2.11) 4(0.5,-2.11) 5(1,-2.11) 6(1,2.11) 7(0.5,2.11) 8(0,2.11) 9(-0.5,2.11) 10(-1,2.11)
OPTO-SMD-4_L4.4-W4.1-P2.54-LS7.0-TL
  rect 1.7x0.95 smd: 1(-3.3,1.27) 2(-3.3,-1.27) 3(3.3,-1.27) 4(3.3,1.27)
Pad_e1300
  round 5 hole 3.2: 1(0,0)
Pad_e1324
  round 5 hole 3.2: 1(0,0)
Pad_e1349
  round 6.48 hole 3.2: 1(0,0)
Pad_e3835
  round 6.48 hole 3.2: 1(0,0)
Pad_e3838
  round 6.48 hole 3.2: 1(0,0)
Pad_e3840
  round 6.48 hole 3.2: 1(0,0)
Pad_e13735
  round 2.2 hole 1.6: 1(0,0)
Pad_e13737
  round 2.2 hole 1.6: 1(0,0)
Pad_e13738
  round 2.2 hole 1.6: 1(0,0)
Pad_e13739
  round 2.2 hole 1.6: 1(0,0)
PWRM-TH_B0505S-3WR2
  rect 1.6x1.6 hole 1: 1(-6.35,0)
  round 1.6 hole 1: 2(-3.81,0) 4(1.27,0) 6(6.35,0)
QFN-28_L6.0-W6.0-P0.65-BL-EP3.7
  oval 0.364x1.055 smd: 1(-1.95,-2.877) 2(-1.3,-2.877) 3(-0.65,-2.877) 4(0,-2.877) 5(0.65,-2.877) 6(1.3,-2.877) 7(1.95,-2.877) 15(1.95,2.877) 16(1.3,2.877) 17(0.65,2.877) 18(0,2.877) 19(-0.65,2.877) 20(-1.3,2.877) 21(-1.95,2.877)
  oval 1.055x0.364 smd: 8(2.877,-1.95) 9(2.877,-1.3) 10(2.877,-0.65) 11(2.877,0) 12(2.877,0.65) 13(2.877,1.3) 14(2.877,1.95) 22(-2.877,1.95) 23(-2.877,1.3) 24(-2.877,0.65) 25(-2.877,0) 26(-2.877,-0.65) 27(-2.877,-1.3) 28(-2.877,-1.95)
  rect 3.7x3.7 smd: 29(0,0)
R0402
  rect 0.566x0.54 smd: 1(-0.433,0) 2(0.433,0)
R0603
  rect 0.806x0.864 smd: 1(-0.753,0) 2(0.753,0)
R0805
  rect 1.133x1.377 smd: 1(-1,0) 2(1,0)
R1206
  rect 1.208x1.701 smd: 1(-1.479,0) 2(1.479,0)
RELAY-TH_ALQ1XX
  round 2.3 hole 1.5: 1(-8.89,-3.81) 2(1.27,-3.81) 3(8.89,-3.81) 4(6.35,3.81) 5(-8.89,3.81)
RES-ADJ-SMD_3P-L3.0-W3.8-P1.75-BR
  rect 1.2x1.2 smd: 1(1.625,-1) 3(1.625,1)
  rect 1.5x1.6 smd: 2(-1.625,0)
SC-70-6_L2.1-W1.3-P0.65-LS2.1-BR
  rect 0.6x0.42 smd: 1(0.95,-0.65) 2(0.95,0) 3(0.95,0.65) 4(-0.95,0.65) 5(-0.95,0) 6(-0.95,-0.65)
SIM-SMD_C9900007362
  rect 0.7x1.6 smd: 1(2.25,5.3) 2(1.15,5.3) 3(0.05,5.3) 4(-1.05,5.3) 5(-2.15,5.3) 6(-3.25,5.3) 7(-4.35,5.3) 8(-5.45,5.3) CD(-6.55,5.3)
  rect 1.2x2.2 smd: G(-7.755,-5.3) G(7.755,-5.3)
  rect 1.2x1.8 smd: G(-7.75,3.99)
  rect 1.6x1.5 smd: G(6.855,4.29)
SMA_L4.3-W2.6-LS5.1-BI
  rect 2x2 smd: 1(-2.2,0) 2(2.2,0)
SMA_L4.3-W2.6-LS5.2-RD
  rect 2x2 smd: 1(-2.2,0) 2(2.2,0)
SMA_L4.3-W2.7-LS5.1-BI
  rect 2.1x1.8 smd: 1(-2.4,0) 2(2.4,0)
SMA_L4.4-W2.8-LS5.4-R-RD
  rect 2.062x1.539 smd: 1(2.503,0) 2(-2.503,0)
SMB_L4.3-W3.6-LS5.4-BI
  rect 2.047x2.241 smd: 1(-2.591,0) 2(2.591,0)
SMB_L4.6-W3.6-LS5.3-RD
  rect 2.047x2.192 smd: 1(-2.361,0) 2(2.361,0)
SMC_L7.1-W6.2-LS8.1-RD
  rect 3.03x3.82 smd: 1(-3.435,0) 2(3.435,0)
SOD-80_L3.5-W1.5-RD
  rect 1.44x1.62 smd: 1(-1.765,0) 2(1.765,0)
SOD-123_L2.8-W1.8-LS3.7-RD
  rect 0.95x1.15 smd: 1(-1.692,0) 2(1.692,0)
SOD-128_L3.7-W2.5-LS4.7-RD
  rect 1.25x1.7 smd: 1(-2.2,0) 2(2.2,0)
SOD-323_L1.8-W1.3-LS2.5-RD
  rect 1x0.75 smd: 1(-1.173,0) 2(1.173,0)
SOIC-8_L5.0-W4.0-P1.27-LS6.0-BL
  oval 0.569x1.95 smd: 1(-1.905,-2.705) 2(-0.635,-2.705) 3(0.635,-2.705) 4(1.905,-2.705) 5(1.905,2.705) 6(0.635,2.705) 7(-0.635,2.705) 8(-1.905,2.705)
SOIC-14_L8.7-W3.9-P1.27-LS6.0-BL
  oval 0.574x2.038 smd: 1(-3.81,-2.769) 2(-2.54,-2.769) 3(-1.27,-2.769) 4(0,-2.769) 5(1.27,-2.769) 6(2.54,-2.769) 7(3.81,-2.769) 8(3.81,2.769) 9(2.54,2.769) 10(1.27,2.769) 11(0,2.769) 12(-1.27,2.769) 13(-2.54,2.769) 14(-3.81,2.769)
SOIC-16_L10.3-W7.5-P1.27-LS10.3-BL
  oval 0.574x2.401 smd: 1(-4.445,-4.75) 2(-3.175,-4.75) 3(-1.905,-4.75) 4(-0.635,-4.75) 5(0.635,-4.75) 6(1.905,-4.75) 7(3.175,-4.75) 8(4.445,-4.75) 9(4.445,4.75) 10(3.175,4.75) 11(1.905,4.75) 12(0.635,4.75) 13(-0.635,4.75) 14(-1.905,4.75) 15(-3.175,4.75) 16(-4.445,4.75)
SOP-4_L6.4-W4.6-P2.54-LS10.2-TL
  rect 2.6x1.423 smd: 1(-4.38,1.27) 2(-4.38,-1.27) 3(4.38,-1.27) 4(4.38,1.27)
SOT-23-3_L2.9-W1.3-P1.90-LS2.4-BR
  rect 1.25x0.7 smd: 1(1,-0.95) 2(1,0.95) 3(-1,0)
SOT-23-3_L2.9-W1.6-P1.90-LS2.8-BR
  rect 1.07x0.6 smd: 1(1.235,-0.95) 2(1.235,0.95) 3(-1.235,0)
SOT-23-3_L3.0-W1.7-P0.95-LS2.9-BR
  rect 1.038x0.532 smd: 1(1.101,-0.95) 2(1.101,0.95) 3(-1.101,0)
SOT-23-6_L2.9-W1.6-P0.95-LS2.8-BR
  rect 1.1x0.6 smd: 1(1.35,-0.95) 2(1.35,0) 3(1.35,0.95) 4(-1.35,0.95) 5(-1.35,0) 6(-1.35,-0.95)
SOT-23-8_L3.0-W1.7-P0.65-LS2.8-BR
  oval 1.252x0.364 smd: 1(1.226,-0.975) 2(1.226,-0.325) 3(1.226,0.325) 4(1.226,0.975) 5(-1.226,0.975) 6(-1.226,0.325) 7(-1.226,-0.325) 8(-1.226,-0.975)
SOT-143_L2.9-W1.3-P1.92-LS2.3-BR
  rect 0.7x1.1 smd: 1(1.1,-0.75)
  rect 0.7x0.6 smd: 2(1.1,0.95) 3(-1.1,0.95) 4(-1.1,-0.95)
SW-SMD_L6.0-W3.5-LS8.0
  rect 1.74x1.4 smd: 1(-3.67,0) 2(3.67,0)
SW-TH_2AS3T1A1M2QES
  round 1.6 hole 1.1: 1(0,-2.54) 2(0,0) 3(0,2.54)
SW-TH_XKB_SS-12M10G5
  oval 2x3 hole 1.2x2.2: 1(-4.7,0) 2(0,0) 3(4.7,0)
TEST-TH_BD2.54-P1.4_RED
  round 1.9 hole 1.2: 1(0,0)
TO-252-5_L6.5-W5.6-P1.27-LS9.5-TL
  rect 2.357x0.7 smd: 1(-3.378,2.54) 2(-3.378,1.27) 3(-3.378,0) 4(-3.378,-1.27) 5(-3.378,-2.54)
  rect 5.324x5.512 smd: 6(3.378,0)
TO-263-2_L10.0-W9.1-P5.08-LS15.2-TL
  rect 3.358x1.134 smd: 1(-5.286,2.54) 3(-5.286,-2.54)
  rect 7.181x10.566 smd: 4(5.286,0)
TO-263-5_L10.2-W8.9-P1.70-TL
  rect 3.2x1.15 smd: 1(-5.008,3.404) 2(-5.008,1.702) 3(-5.008,0) 4(-5.008,-1.702) 5(-5.008,-3.404)
  custom 8.128x10.922 smd: 6(5.008,-0.318)
TSOT-23-5_L2.9-W1.6-P0.95-LS2.8-BL
  rect 0.532x1.045 smd: 1(-0.95,-1.147) 2(0,-1.147) 3(0.95,-1.147) 4(0.95,1.147) 5(-0.95,1.147)
USB-C-SMD_TYPE-C-6PIN-2MD-073
  rect 0.55x1.1 smd: 1(-3.2,2.375) 2(-2.4,2.375) 11(2.4,2.375) 12(3.2,2.375)
  rect 0.3x1.1 smd: 3(-1.75,2.375) 4(-1.25,2.375) 5(-0.75,2.375) 6(-0.25,2.375) 7(0.25,2.375) 8(0.75,2.375) 9(1.25,2.375) 10(1.75,2.375)
  oval 1.1x2 hole 0.6x1.5: 13(-4.325,1.825) 14(4.325,1.825)
  oval 1.2x1.8 hole 0.6x1.2: 13(-4.325,-2.375) 14(4.325,-2.375)
WIRELM-SMD_ESP32-S3-WROOM-1U
  rect 1.5x0.9 smd: 1(-8.75,8.895) 2(-8.75,7.625) 3(-8.75,6.355) 4(-8.75,5.085) 5(-8.75,3.815) 6(-8.75,2.545) 7(-8.75,1.275) 8(-8.75,0.005) 9(-8.75,-1.265) 10(-8.75,-2.535) 11(-8.75,-3.805) 12(-8.75,-5.075) 13(-8.75,-6.345) 14(-8.75,-7.615) 27(8.75,-7.615) 28(8.75,-6.345) 29(8.75,-5.075) 30(8.75,-3.805) 31(8.75,-2.535) 32(8.75,-1.265) 33(8.75,0.005) 34(8.75,1.275) 35(8.75,2.545) 36(8.75,3.815) 37(8.75,5.085) 38(8.75,6.355) 39(8.75,7.625) 40(8.75,8.895)
  rect 0.9x1.5 smd: 15(-6.985,-8.895) 16(-5.715,-8.895) 17(-4.445,-8.895) 18(-3.175,-8.895) 19(-1.905,-8.895) 20(-0.635,-8.895) 21(0.635,-8.895) 22(1.905,-8.895) 23(3.175,-8.895) 24(4.445,-8.895) 25(5.715,-8.895) 26(6.985,-8.865)
  rect 0.9x0.9 smd: 41(-2.9,2.575) 41(-2.9,1.175) 41(-2.9,-0.225) 41(-1.5,2.575) 41(-1.5,1.175) 41(-1.5,-0.225) 41(-0.1,2.575) 41(-0.1,1.175) 41(-0.1,-0.225)
WSOIC-16_L10.3-W7.5-P1.27-LS10.3-BL
  rect 0.65x2.2 smd: 1(-4.445,-5) 2(-3.175,-5) 3(-1.905,-5) 4(-0.635,-5) 5(0.635,-5) 6(1.905,-5) 7(3.175,-5) 8(4.445,-5) 9(4.445,5) 10(3.175,5) 11(1.905,5) 12(0.635,5) 13(-0.635,5) 14(-1.905,5) 15(-3.175,5) 16(-4.445,5)
WSON-8_L8.0-W6.10-P1.27-BL-EP
  oval 0.56x1.4 smd: 1(-1.905,-4.027) 2(-0.635,-4.027) 3(0.635,-4.027) 4(1.905,-4.027) 5(1.905,4.027) 6(0.635,4.027) 7(-0.635,4.027) 8(-1.905,4.027)
  rect 4.3x3.4 smd: 9(0,0)

## Nets
As in the schematic.

Pads without a net: BUZZER1 3 4; FPC1 45 49 50 51 52 53 54; LED27 2; NOREF 1; NOREF#2 1; NOREF#3 1; NOREF#4 1; NOREF#5 1; NOREF#6 1; NOREF#7 1; NOREF#8 1; NOREF#9 1; NOREF#10 1; U3 3; U8 3; U11 3 7 8; U20 28 29 30; U22 7 10 15 16; U23 2 3 4 7 10 15 16; U24 8 9 10 11 12 13; U25 5 7 10 12; U29 1 3 4; U31 1 8; U51 3 7 8; U57 7 8; U58 7 8; USB1 3 9

## Via types
v1: diameter 0.61, hole 0.305, Top Layer to Bottom Layer, 998 vias
v2: diameter 1.219, hole 0.61, Top Layer to Bottom Layer, 34 vias

## Routing (per net, layer and track width the routed paths; a pad name or vN(x,y) marks a point on that pad's centre or on a via; arc(x,y) is an arc through that point)
3V3: length 201.4
  Top Layer w0.254: U21.1 22.92,112.72 23.37,113.17 ; 21,11.05 21,11.79 21.26,12.05 ; 153.24,62.47 153.23,62.46 ; 153.23,62.01 153.23,61.46 152.71,61.46 ; 211.33,29.35 210.97,29.35 210.62,29 U33.8 ; v1(44.86,9.84) 45.06,9.84 45.5,10.28 FPC1.7
  Top Layer w0.305: 152.15,61.45 152.15,61.46 152.71,61.46 ; 153.23,62.46 153.23,62.01 ; 29.49,11.05 29.49,10.12 v1(29.25,9.88) 29,10.13 29,11.05 ; 23.37,113.17 23.37,113.42
  Top Layer w0.355: 142.44,38 143.36,38
  Top Layer w0.381: 21.26,12.05 21.46,12.26 21.74,12.26 22,12.53 22,12.94 ; 79.5,77.61 79.72,77.39 79.72,76.28 ; 212.13,29.57 212.14,29.57 C64.2 ; 153.23,60.16 152.81,60.16 v1(152.26,59.61) ; 23.37,113.42 23.37,114.15
  Top Layer w0.508: C49.2 89.25,50.44 U25.1 ; 23.37,114.15 C43.2 ; 143.36,38 144.62,38 C47.2 ; C48.2 76.45,27.49 U24.14 ; 47.94,58.48 47.94,57.54 48.29,57.19 48.8,57.19 49.2,57.59 U30.8 ; U30.3 46.66,68.79 C57.2 ; C59.2 16.85,66.86 16.48,67.23 U31.4 ; 22,12.96 C41.2 ; R27.2 v1(18.92,113.6) ; C45.2 78.6,78.51 79.5,77.61 ; R42.2 153.24,62.47 ; 212.13,29.57 211.81,29.57 211.58,29.35 211.33,29.35 ; U29.2 98.68,51.99 ; 152.15,61.45 C61.2
  Top Layer w0.762: R77.1 175.8,100.18 v1(176.28,99.71) ; v1(78.51,101.13) 79.66,101.13 R114.2 ; 18.8,90.57 v1(18.8,91.71) ; v1(15.11,101.84) C37.2 C38.2 19.86,101.84 19.96,101.75 U20.2 ; R95.1 v1(133.76,101.17) ; v1(214.88,29.57) C65.2 C64.2 ; 75.11,3.02 v1(75.11,1.79) ; C54.2 98.7,51.87 C55.1 v1(98.7,48.4) ; C43.2 C42.2 v1(24.51,115.71) ; R99.1 v1(105.06,101.17) ; v1(92.9,101.17) R100.2 ; R38.1 18.29,60.47 18.8,59.96 v1(19.05,59.96) ; v1(136.1,101.17) R82.2 ; v1(17.02,74.82) 18.28,74.82 R39.1 ; U36.4 v1(155.76,28.84) ; C61.2 C60.2 v1(148.77,62.62) ; v1(150.35,101.17) R81.2 ; 20.58,62.93 20.58,61.99 v1(20.32,61.73) ; R78.1 v1(162.75,101.17) ; v1(164.83,101.17) R79.2 ; C48.2 76.39,28.46 v1(74.3,28.46) ; D17.2 205.52,15.38 v1(205.83,15.38) ; C41.2 22.39,14.75 v1(22.39,15.38) ; v1(19.81,71.34) 19.81,70.25 R40.1 ; v1(136.53,45.35) 135.9,44.72 R29.2 R30.2 ; R18.1 50.04,14.37 v1(50.04,15.51) ; U37.4 v1(128.93,28.84) ; v1(107.14,101.17) R98.2 ; C59.2 21.07,66.86 C58.1 v1(23.11,66.88) ; R41.1 v1(51.94,68.47) ; R22.2 v1(1.91,106.82) ; v1(219.25,15.38) 218.94,15.38 D21.2 ; R23.2 v1(4.45,113.17) ; C57.2 C56.1 v1(48.01,71.4) ; U39.4 v1(142.34,28.84) ; R28.2 74.31,68.47 v1(73.66,68.47) ; D22.2 245.64,15.51 v1(246.08,15.51) ; v1(70.74,1.79) 70.74,2.94 70.66,3.02 ; C45.2 C44.1 79.01,81.06 79.63,81.67 v1(79.63,82.31) ; R97.1 v1(119.36,101.17) ; U38.4 v1(169.17,28.84) ; R113.1 v1(90.57,101.17) ; R46.1 v1(201.42,31.12) ; D18.2 232.22,15.51 v1(232.66,15.51) ; 20.66,133.96 v1(21.97,133.96) ; v1(147.21,36.84) C46.1 C47.2 ; U35.4 v1(115.51,28.84) ; 24.04,82.69 v1(24.04,81.55) ; v1(12.7,44.34) 13.05,44.69 D44.1 10.9,45.51 BUZZER1.1 ; R24.2 v1(38.66,16.92) ; C49.2 v1(90.55,50.51) ; 20.66,130.55 v1(21.97,130.55) ; U40.4 v1(182.58,28.84) ; R115.1 v1(76.18,101.13) ; v1(121.7,101.17) R96.2 ; R80.1 v1(148.23,101.17) ; R116.2 v1(64.01,101.13)
  Top Layer w1.016: R126.2 208.53,101.11 v1(207.52,100.09) ; R153.1 v1(273.81,101.14) ; R147.1 v1(257.3,101.14) ; R148.2 v1(244.86,101.14) ; R159.1 v1(290.07,101.14) ; R125.1 220.22,101.11 v1(221.23,100.09) ; R154.2 v1(261.37,101.14) ; R131.1 v1(239.78,101.11) ; R160.2 v1(277.88,101.14) ; R132.2 v1(227.58,101.11)
  Top Layer w1.778: v2(29.97,44.72) 47.24,44.72 v2(49.4,46.88)
  Bottom Layer w2.032: U57.5 U57.6 46.87,70.26 v1(48.01,71.4) v2(49.53,71.4)
  vias: v1(48.58,57.19) v1(181.36,49.8) v1(181.36,48.66) v1(181.36,47.51) v1(182.85,46.88) v1(184.44,46.88) v1(185.86,50.75) v1(185.86,49.61) v1(185.86,48.46) v1(187.45,53.04) v1(187.45,51.89) v1(187.45,50.75) v1(187.45,49.61)
+5V: length 80.9
  Top Layer w0.508: R10.2 66.27,3.7 v1(66.29,3.73)
  Top Layer w0.762: 7.38,96 v1(8.36,96) 10.13,96 D1.1 v1(10.14,94.68) ; v1(47.5,96.41) 49.01,96.41 LED27.1
  Top Layer w1.524: C17.2 C13.2 201.03,50.7 U5.1 208.08,50.69 U4.1 ; 210.16,48.62 D3.1 215.39,46.37 216.72,45.04 R139.2
  Bottom Layer w3.048: U4.1 210.15,46.72 204.34,40.91 v2(177.26,40.91) v2(174.05,40.91) v2(170.85,40.91) v2(167.64,40.91)
  vias: v1(7.37,95.99) v1(12.77,36.9) v1(12.77,35.76) v1(12.77,34.61) v1(12.77,33.47) v1(12.77,32.33) v1(64.26,13.35) v1(64.26,12.21) v1(64.26,11.06) v1(65.28,12.21) v1(65.28,11.06)
+5V(ISO): length 221.3
  Top Layer w0.508: U26.8 97.16,32.36 C52.2 v1(98.79,31.13) ; v1(90.78,36) 90.23,35.46 89.46,35.46 89.51,35.51 89.51,36.26 89.26,36.51 89.26,37.88 U25.16 ; R33.2 v1(93.12,41.8)
  Top Layer w0.762: v1(91.44,29.1) 91.95,29.1 92.46,28.58 R36.1 ; 211.5,113.81 210.65,114.66 210.65,116.91 210.68,116.94 ; R34.2 101.22,37.99 v2(102.62,39.38) ; 212.73,113.77 212.71,113.77 ; 230.79,113.81 229.9,114.69 229.9,116.94 229.94,116.98
  Top Layer w1.27: v1(207.01,105.55) 208.28,104.28 U49.4 ; v2(205.62,109.48) 209.94,113.81 D41.1 ; v1(224.28,111.14) 226.95,113.81 D43.1 ; v1(226.82,105.04) 227.58,104.28 U52.4
  Top Layer w1.524: U5.6 200.97,63.32 194.39,63.32 U6.1 R140.2
  Top Layer w2.032: v2(122.17,65.93) 124.21,67.96 139.95,67.96 v2(143.26,71.26)
  Bottom Layer w2.032: 185.93,77.1 194.39,68.64 U6.1 ; 185.93,77.1 185.93,97.17 199.52,110.76 v2(204.34,110.76) v2(205.62,109.48) v2(206.76,108.34) ; 185.93,77.1 180.09,71.26 v2(143.26,71.26) ; v2(122.17,65.93) 102.62,46.37 v2(102.62,43.05) v2(102.62,41.17) v2(102.62,39.38)
+12V: length 85.4
  Top Layer w1.524: v2(227.09,77.1) v2(227.09,75.32) v2(227.09,73.64) v2(227.09,71.95) C11.2
  Bottom Layer w1.778: U2.1 252.35,113.55 255.22,116.42 H2.1 H3.1 H4.1
  vias: v1(51.83,118.03) v1(51.83,116.89) v1(52.97,118.03) v1(52.97,116.89) v1(249.92,72.37) v1(249.92,70.85) v1(251.95,72.37) v1(251.95,70.85) v1(253.98,72.37) v1(253.98,70.85) v1(256.16,68.21) v1(257.43,68.21) v1(263.89,66.72) v1(263.89,64.94) v1(263.89,63.16) v1(264.67,60.91) v1(264.67,59.77) v1(265.67,66.72) v1(265.67,64.94) v1(265.67,63.16) v1(265.94,60.91) v1(265.94,59.77) v1(267.44,66.72) v1(267.44,64.94) v1(267.44,63.16)
+24V: length 115
  Bottom Layer w1.778: U1.1 290.83,38.75 293.37,41.29 293.37,108.46 H4.3 H3.3 H2.3
  vias: v1(263.02,48.81) v1(264.8,48.81) v1(265.75,35.41) v1(265.75,33.06) v1(266.57,48.81) v1(268.35,48.81) v1(270.13,48.81) v1(277.81,35.66) v1(277.81,34.52) v1(279.39,36.35) v1(279.39,35.2) v1(281.04,36.35) v1(281.04,35.2) v1(281.33,39.42) v1(281.33,38.28) v1(282.61,36.35) v1(284.01,36.35)
AVDD_LCD: length 72.5
  Top Layer w0.254: 27.5,11.05 27.5,9.94
  Top Layer w0.762: D11.1 35.28,22.21 33.78,20.71 33.78,18.17 32.26,16.65 29.02,16.65 v1(28.48,16.11) ; C34.2 12.55,21.49 13.97,20.08 13.97,4 15.29,2.68 26.06,2.68 27.5,4.12 27.5,9.93 v1(27.48,9.94) ; C34.2 10.34,19.88 9.84,19.38 9.52,19.38 ; C34.2 10.34,23.43 9.25,24.52 5.12,24.52 4.1,25.54 U19.2
  Bottom Layer w0.762: v1(27.48,9.94) 27.48,15.11 v1(28.48,16.11)
GND: length 443.3
  Top Layer w0.254: U14.9 190.72,49.29 U14.6 ; 79.07,76.28 79.07,74.7 U22.29 ; R16.1 9.09,26.69 v1(9.09,27.64) 9.09,29.24 8.63,29.71 U18.2 ; U23.12 138.91,41.11 138.81,41.21 v1(138.6,41.21) 138.37,41.21 138.26,41.1 138.26,38.66 U23.29 ; 79.72,72.75 U22.12 77.45,72.78 76.45,72.78 76.27,72.96 76.27,73.07 v1(76.2,73.14) 76.45,73.4 U22.11 ; U20.41 U20.41 ; U20.41 27.07,95.99 ; U20.41 27.07,94.59 ; 31.5,11.05 31.5,10.13 v1(31.25,9.88) 31,10.13 31,11.05 ; FPC1.19 39.5,10.23 39.84,9.88 v1(40.01,9.88) ; C40.1 20.89,12.55 20.5,12.15 20.5,11.05 ; U11.2 268.78,25.74 268.48,25.44 ; U21.2 21.98,113.17 22.32,113.51 22.32,114.19 ; 27.77,96.69 U20.41 28.47,96 ; v1(24.73,12.57) 25,12.31 25,11.05 ; FPC1.18 40.01,11.04 v1(40.01,9.88) ; 27.07,96 U20.41 ; 28.47,94.59 U20.41 ; U20.41 27.77,93.89 ; U20.41 U20.41 ; v1(58.67,8.78) 59.28,8.17 U17.2 ; USB1.1 v1(8.51,90.82) ; C32.1 v1(5.61,32.55) ; U20.41 U20.41 ; U20.41 29.87,95.99 ; U20.41 29.87,94.59 ; 32.49,11.05 32.49,10.11 v1(32.26,9.88) 32,10.15 32,11.05 ; 154.68,61.46 154.28,61.46 153.63,60.81 U32.7 152.55,60.81 ; U20.41 28.47,94.59 ; U20.41 28.47,95.99 ; v1(40.01,9.88) 40.17,9.88 40.5,10.21 FPC1.17 ; 29.17,96.69 U20.41 29.87,96 ; 35.99,11.05 35.99,10.11 v1(35.75,9.88) 35.51,10.12 35.51,11.04 FPC1.27 ; 143.48,39.13 143.01,38.66 142.44,38.66 ; U20.41 27.07,94.59 ; U22.13 79.07,72.1 ; FPC1.5 46.5,11.84 v1(47.12,12.46) ; 30,11.05 30,11.91 30.28,12.19 v1(30.71,12.19) ; U21.5 v1(21.98,110) ; USB1.12 v1(8.51,84.42) ; U33.3 v1(207.01,29) ; U34.6 v1(48.9,122.6)
  Top Layer w0.305: 152.55,60.81 152.36,60.81 152.02,60.47
  Top Layer w0.355: 142.44,38.66 140.86,38.66
  Top Layer w0.381: 79.07,76.28 79.07,76.77 78.23,77.61 77.49,77.61 77.22,77.88 77.22,78.76 C45.1
  Top Layer w0.508: 17.45,7.8 17.45,8.95 v1(17.98,9.49) ; 256.22,98.28 v1(257.3,98.28) ; FPC1.62 50,7.76 v1(48.44,7.76) ; v1(144.67,40.78) C47.1 144.67,39.46 143.81,39.46 143.48,39.13 ; v1(17.05,55) R137.1 16.99,53.96 U53.2 ; 161.62,98.31 v1(162.56,98.31) ; C24.1 39.56,19.63 v1(38.99,19.06) 38.35,18.43 36.83,18.43 36.27,18.99 C23.1 ; 6.2,29.76 5.61,30.34 C32.1 ; 6.2,29.76 6.25,29.71 U18.2 ; 6.2,29.76 5.64,29.2 5.64,28.75 C33.1 ; R1.1 9.4,78.88 v1(9.84,79.33) 10.47,79.95 C1.1 ; v1(12.32,17.39) 8.15,17.39 8.14,17.38 ; C29.1 62.41,3.67 v1(62.43,3.7) ; U25.8 v1(80.36,49.42) ; v1(87.91,51.75) C49.1 87.98,50.44 U25.2 ; v1(57.53,3.7) 58.77,3.7 C28.1 ; LED27.3 v1(53.59,101.45) ; v1(17.53,67.96) 17.83,68.26 C59.1 21.07,68.26 C58.2 ; 272.63,98.28 v1(273.81,98.28) ; v1(50.67,115.2) R52.1 49.52,113.93 R51.1 v1(49.91,113.17) ; C64.1 v1(212.34,31.89) ; v1(12.7,68.72) 13.41,69.43 U31.6 ; C46.2 v1(147.21,40.78) ; U20.1 21.23,103.01 v1(22.86,103.01) ; 147.21,98.31 v1(148.34,98.31) ; 89.55,98.31 v1(90.68,98.31) ; v1(20.91,15.28) C41.1 20.91,12.96 C40.1 ; D8.2 32.01,20.4 C19.1 31.56,18.79 30.89,18.12 v1(29.97,18.12) ; R9.1 v1(39.5,21.87) ; v1(14.99,27.57) 14.99,28.96 C30.1 14.7,28.74 13.87,28.74 13.32,29.29 C31.1 v1(12.53,27.69) 12.53,26.95 R14.1 ; 219.52,98.25 v1(220.47,98.25) ; 103.97,98.31 v1(105.16,98.31) ; 289.05,98.28 v1(290.07,98.28) ; SW2.1 v1(10.79,109.36) ; 75.15,98.27 v1(76.2,98.27) ; C61.1 151.61,60.05 152.02,60.47 ; R2.1 v1(5,94.63) ; R25.1 v1(19.15,82.69) ; v1(45.33,72.66) C56.2 C57.1 45.4,68.79 45.4,66.54 ; C65.1 v1(213.87,31.89) ; C51.1 69.94,18.81 U24.7 ; SW1.1 v1(10.79,100.47) ; 238.79,98.25 v1(239.78,98.25) ; 15.24,72.77 15.09,72.92 15.09,73.51 14.66,73.93 U31.G ; 118.38,98.31 v1(119.38,98.31) ; C34.1 8.34,22.53 7.62,23.25 v1(6.03,23.25) 5.51,23.25 v1(5.26,23) 5.26,22.09 5.61,21.74 ; 132.79,98.31 v1(133.86,98.31) ; 176.04,98.31 v1(177.04,98.31) ; C39.1 v1(4.45,106.82) ; U20.40 v1(40.13,103.02) ; R3.1 v1(5,80.66)
  Top Layer w0.635: v1(23.93,23.31) 24.27,22.96 R7.1 ; 45.4,66.54 45.4,64.41 46.8,63.01 U30.9 ; 47.8,63.01 48.43,63.64 49.69,63.64 v1(51,64.96) ; R26.2 25.5,15.54 v1(25.5,16.64) C21.1 ; v1(22.91,19.5) 24.14,20.72 C20.1 ; R21.1 v1(40.69,83.45) ; U9.3 228.8,65.32
  Top Layer w0.762: v1(121.92,98.44) 123.22,98.44 R109.1 ; C9.1 v1(266.55,73.55) ; R112.1 v1(92.96,98.36) ; C61.1 C60.1 v1(148.77,58.31) v1(149.39,57.69) R43.2 ; R12.1 v1(55.65,3.95) ; 227.4,16.69 227.4,15.28 229.74,12.94 229.74,10.4 ; 227.4,16.69 227.33,16.76 ; 227.4,16.69 227.52,16.57 ; R122.1 v1(78.74,98.36) ; 41.65,124.11 41.6,124.16 v1(40.39,124.16) ; 41.65,124.11 R50.2 ; 41.65,124.11 C68.2 ; 243.21,10.4 243.21,12.94 240.86,15.28 240.86,16.69 ; 22.32,114.19 22.32,115.71 v1(21.08,115.71) ; 216.33,10.43 216.33,12.97 213.98,15.32 213.98,16.73 213.93,16.78 ; 243.4,15.99 243.4,16.23 242.98,16.65 240.93,16.65 ; C48.1 v1(76.45,31.13) ; C47.1 C46.2 ; 214.02,16.69 214.06,16.65 216.17,16.65 216.59,16.23 216.59,15.94 ; 214.28,21.09 v1(214.28,22.49) ; 227.78,21.09 v1(227.78,22.49) ; v1(206.25,33.41) 206.25,32.15 R47.1 ; 240.86,16.69 240.81,16.75 ; 240.86,16.69 240.91,16.64 ; v1(75.95,78.77) C45.1 77.22,78.79 v1(77.22,82.31) ; R93.1 v1(150.62,98.36) ; 241.19,21.09 v1(241.19,22.49) ; D17.1 203.17,16.17 202.75,16.59 200.61,16.59 200.66,16.53 200.66,15.13 203.01,12.78 CN2.2 ; R91.1 v1(165.1,98.36) ; 39.14,129.11 39.12,129.13 37.19,129.13 35.72,130.6 35.72,132.94 D25.2 ; v1(50.29,120.66) C71.1 49.34,120.03 U34.11 ; 228.8,65.32 229.77,65.32 ; C51.1 v1(71.12,16.5) ; U20.1 21.22,103.01 20.12,103.01 19.88,103.24 C38.1 C37.1 v1(16.38,104.43) ; C63.1 v1(222.87,22.49) ; C7.1 v1(261.62,52.41) ; C62.1 v1(196.04,22.49) ; 53.59,129.11 51.63,129.11 50.15,130.58 D26.2 ; 229.98,16.09 229.98,16.23 229.56,16.65 227.61,16.65 ; U12.1 v1(259.79,55.77) ; C66.1 v1(209.46,22.49) ; R124.1 v1(64.26,98.32) ; R111.1 v1(107.44,98.36) ; C67.1 v1(236.29,22.49) ; R94.1 v1(136.14,98.36) ; 200.95,21.09 v1(200.95,22.49) ; R11.1 v1(53.11,3.95) ; C26.1 v1(66.29,7.56)
  Top Layer w1.016: 262.51,29.27 v1(262.51,30.81) v1(262.51,31.92) 261.95,32.47 260.81,32.47 ; R76.1 v1(188.3,26.56) ; R68.1 v1(174.88,26.56) ; LED21.1 v1(238.76,74.42) ; v1(15.24,57.8) 15.24,58.35 U31.G ; 191.52,52.76 v1(191.52,54.24) ; U54.3 v1(246.79,108.34) ; v1(260.95,78.48) v1(260.95,77.57) v1(260.95,76.5) C8.2 ; 13.97,73.93 v1(13.97,75.2) ; v1(148.08,26.56) 148.08,25.23 R74.1 ; U15.1 v1(193.5,46.37) v1(194.26,47.13) 194.26,48.64 C17.1 ; R66.1 v1(134.64,26.56) ; R158.1 v1(261.62,98.33) ; v1(161.54,26.56) 161.54,25.28 R59.1 ; 4.68,73.94 4.7,73.95 v1(4.7,75.2) ; LED18.1 v1(177.29,52.64) ; LED19.1 v1(226.57,45.05) ; 229.77,65.32 U9.6 ; R58.1 v1(121.23,26.56) ; U55.3 263.17,106.82 v1(261.37,106.82) ; R164.1 v1(278.13,98.33) ; C13.1 v1(197.36,47.13) ; 191.52,52.68 191.52,51.96 190.75,51.19 190.75,49.82 U14.9 ; R134.1 v1(227.84,98.3) ; 4.68,58.42 v1(4.68,57.16) ; R152.1 v1(245.11,98.33) ; R129.1 v1(208.53,98.3) ; LED22.1 v1(270.26,38.77) ; U56.3 v1(277.62,106.86)
  Top Layer w1.524: D47.1 281.5,139.87 CN26.2 ; CN7.2 49.97,133.1 D26.2 ; CN24.2 248.67,139.87 248.67,134.82 ; 265.05,139.9 265.05,134.86 D46.1 ; C5.1 v2(275.21,29.5) ; 35.72,132.94 35.56,133.1 CN6.2
  Top Layer w2.54: v2(288.67,79.49) v2(288.67,78.09) v2(288.67,76.62) D5.2 ; v2(209.55,74.69) v2(211.26,74.69) D6.2 ; v2(250.57,49.6) v2(250.57,51) v2(250.57,52.47) C10.2
  Bottom Layer w0.508: 27.77,96.69 27.77,100.38 25.15,103.01 v1(22.86,103.01)
  vias: v1(1.78,138.32) v1(1.78,131.97) v1(1.78,74.82) v1(1.78,68.47) v1(1.78,62.12) v1(1.78,55.77) v1(1.78,49.42) v1(1.78,43.07) v1(1.78,36.72) v1(1.78,30.37) v1(1.78,24.02) v1(1.78,17.67) v1(1.78,11.32) v1(8.13,138.32) v1(9.09,68.47) v1(9.09,62.12) v1(9.8,104.69) v1(16,144.67) v1(16.31,23.05) v1(18.49,108.04) v1(19.05,19.09) v1(19.66,22.29) v1(19.76,79.19) v1(20.83,106.57) v1(20.83,55.77) v1(20.83,30.37) v1(20.83,17.67) v1(23.11,34.18) v1(27.18,131.97) v1(27.18,119.27) v1(27.18,106.57) v1(27.18,87.52) v1(28.32,1.97) v1(33.53,144.67) v1(33.53,100.22) v1(33.53,93.87) v1(34.67,1.97) v1(38.71,109.16) v1(39.88,144.67) v1(39.88,126.12) v1(39.88,119.27) v1(41.02,1.97) v1(42.77,116.62) v1(43.28,109.16) v1(46.23,131.97) v1(46.23,36.72) v1(46.33,51.3) v1(47.37,1.97) v1(48.06,76.03) v1(52.58,144.67) v1(52.58,112.92) v1(52.58,93.87) v1(52.58,87.52) v1(52.58,81.17) v1(52.58,43.07) v1(52.58,24.02) v1(52.58,17.67) v1(53.59,76.09) v1(54.25,10.55) v1(58.93,131.97) v1(58.93,125.62) v1(58.93,119.27) v1(58.93,112.92) v1(58.93,81.17) v1(58.93,43.07) v1(58.93,36.72) v1(58.93,30.37) v1(58.93,17.67) v1(65.28,81.17) v1(65.28,74.82) v1(65.28,36.72) v1(65.28,17.67) v1(71.83,24.07) v1(72.08,76.95) v1(72.59,17.62) v1(72.75,13.35) v1(72.85,6.49) v1(77.57,23.97) v1(77.57,17.62) v1(77.57,11.26) v1(90.68,62.12) v1(92.51,45.81) v1(95.2,62.32) v1(97.03,74.82) v1(97.03,68.47) v1(100.18,61.1) v1(101.7,51.96) v1(101.7,49.96) v1(101.85,65.62) v1(103.12,65.62) v1(103.23,51.96) v1(103.23,49.97) v1(104.39,65.62) v1(104.75,51.96) v1(105.65,65.62) v1(107.49,53.99) v1(108.71,49.3) v1(109.73,68.47) v1(109.98,50.69) v1(110.74,47.13) v1(112.52,47.13) v1(112.52,45.1) v1(114.3,47.13) v1(114.3,45.1) v1(116.08,68.47) v1(116.08,55.77) v1(116.08,49.42) v1(116.08,36.72) v1(116.08,4.97) v1(116.33,31.13) v1(122.43,74.82) v1(122.43,62.12) v1(122.43,55.77) v1(122.43,49.42) v1(122.43,4.97) v1(128.78,4.97) v1(135.13,93.87) v1(135.13,4.97) v1(141.48,74.82) v1(141.48,62.12) v1(141.48,4.97) v1(143.61,49.72) v1(143.71,46.37) v1(147.83,74.82) v1(147.83,68.47) v1(147.83,4.97) v1(154.18,74.82) v1(154.18,68.47) v1(154.18,49.42) v1(160.53,74.82) v1(160.53,68.47) v1(160.53,55.77) v1(160.53,4.97) v1(166.88,74.82) v1(166.88,68.47) v1(166.88,62.12) v1(166.88,49.42) v1(166.88,30.37) v1(166.88,17.67) v1(166.88,4.97) v1(173.23,74.82) v1(173.23,68.47) v1(173.23,62.12) v1(173.23,55.77) v1(173.23,49.42) v1(173.23,4.97) v1(179.58,93.87) v1(179.58,74.82) v1(179.58,68.47) v1(179.58,62.12) v1(179.58,30.37) v1(179.58,17.67) v1(185.93,4.97) v1(192.28,4.97) v1(198.63,92.6) v1(198.63,4.97) v1(204.98,100.22) v1(204.98,93.87) v1(204.98,4.97) v1(211.33,68.47) v1(211.33,62.12) v1(211.33,55.77) v1(211.33,43.07) v1(211.33,4.97) v1(217.68,49.42) v1(217.68,4.97) v1(224.03,100.22) v1(224.03,93.87) v1(224.03,74.82) v1(224.03,49.42) v1(224.03,4.97) v1(230.38,4.97) v1(231.55,70.9) v1(231.55,69.38) v1(231.55,60.8) v1(231.55,59.27) v1(231.55,57.75) v1(231.55,56.22) v1(231.55,54.7) v1(233.32,60.8) v1(233.32,59.27) v1(233.32,57.75) v1(233.32,56.22) v1(233.32,54.7) v1(233.32,52.97) v1(233.58,70.9) v1(233.58,69.38) v1(235.1,60.8) v1(235.46,70.9) v1(235.46,69.38) v1(236.73,68.47) v1(236.73,62.12) v1(236.73,55.77) v1(236.73,49.42) v1(236.73,43.07) v1(236.73,36.72) v1(236.73,4.97) v1(243.08,93.87) v1(243.08,87.52) v1(243.08,68.47) v1(243.08,62.12) v1(243.08,55.77) v1(243.08,36.72) v1(243.08,24.02) v1(243.08,4.97) v1(249.43,144.67) v1(249.43,87.52) v1(249.43,43.07) v1(249.43,30.37) v1(249.43,24.02) v1(249.43,17.67) v1(249.43,11.32) v1(255.78,144.67) v1(255.78,119.27) v1(255.78,87.52) v1(255.78,49.42) v1(255.78,43.07) v1(255.78,30.37) v1(255.78,24.02) v1(255.78,4.97) v1(262.13,144.67) v1(262.13,119.27) v1(262.13,87.52) v1(262.13,43.07) v1(266.34,17.77) v1(267.87,58.61) v1(268.48,144.67) v1(268.48,119.27) v1(268.48,106.57) v1(268.48,87.52) v1(268.48,43.07) v1(268.48,25.43) v1(268.63,59.63) v1(270.15,59.63) v1(270.15,58.61) v1(274.83,144.67) v1(274.83,138.32) v1(274.83,131.97) v1(274.83,125.62) v1(274.83,119.27) v1(274.83,106.57) v1(274.83,93.87) v1(274.83,87.52) v1(274.83,43.07) v1(274.83,4.97) v1(281.18,144.67) v1(281.18,43.07) v1(281.18,11.32) v1(281.18,4.97) v1(281.94,26.06) v1(281.94,24.66) v1(282.4,21.19) v1(283.46,18.68) v1(284.73,21.19) v1(285.11,26.04) v1(285.11,24.64) v1(287.53,144.67) v1(287.53,87.52) v1(287.53,62.12) v1(287.53,55.77) v1(287.53,49.42) v1(287.53,43.07) v1(287.53,17.67) v1(287.53,11.32) v1(287.53,4.97) v1(292,24.02) v1(293.88,138.32) v1(293.88,131.97) v1(293.88,125.62) v1(293.88,119.27) v1(293.88,112.92) v1(293.88,36.72) v1(293.88,30.37) v1(293.88,11.32) v1(295.45,17.97) v1(297.18,82.82) v1(297.18,76.47) v1(297.18,70.12) v1(297.18,63.77) v1(297.18,58.94) v1(297.18,52.59) v1(297.18,46.24) v1(297.18,39.89)
